# Altium project ADC_IO.PrjPcb
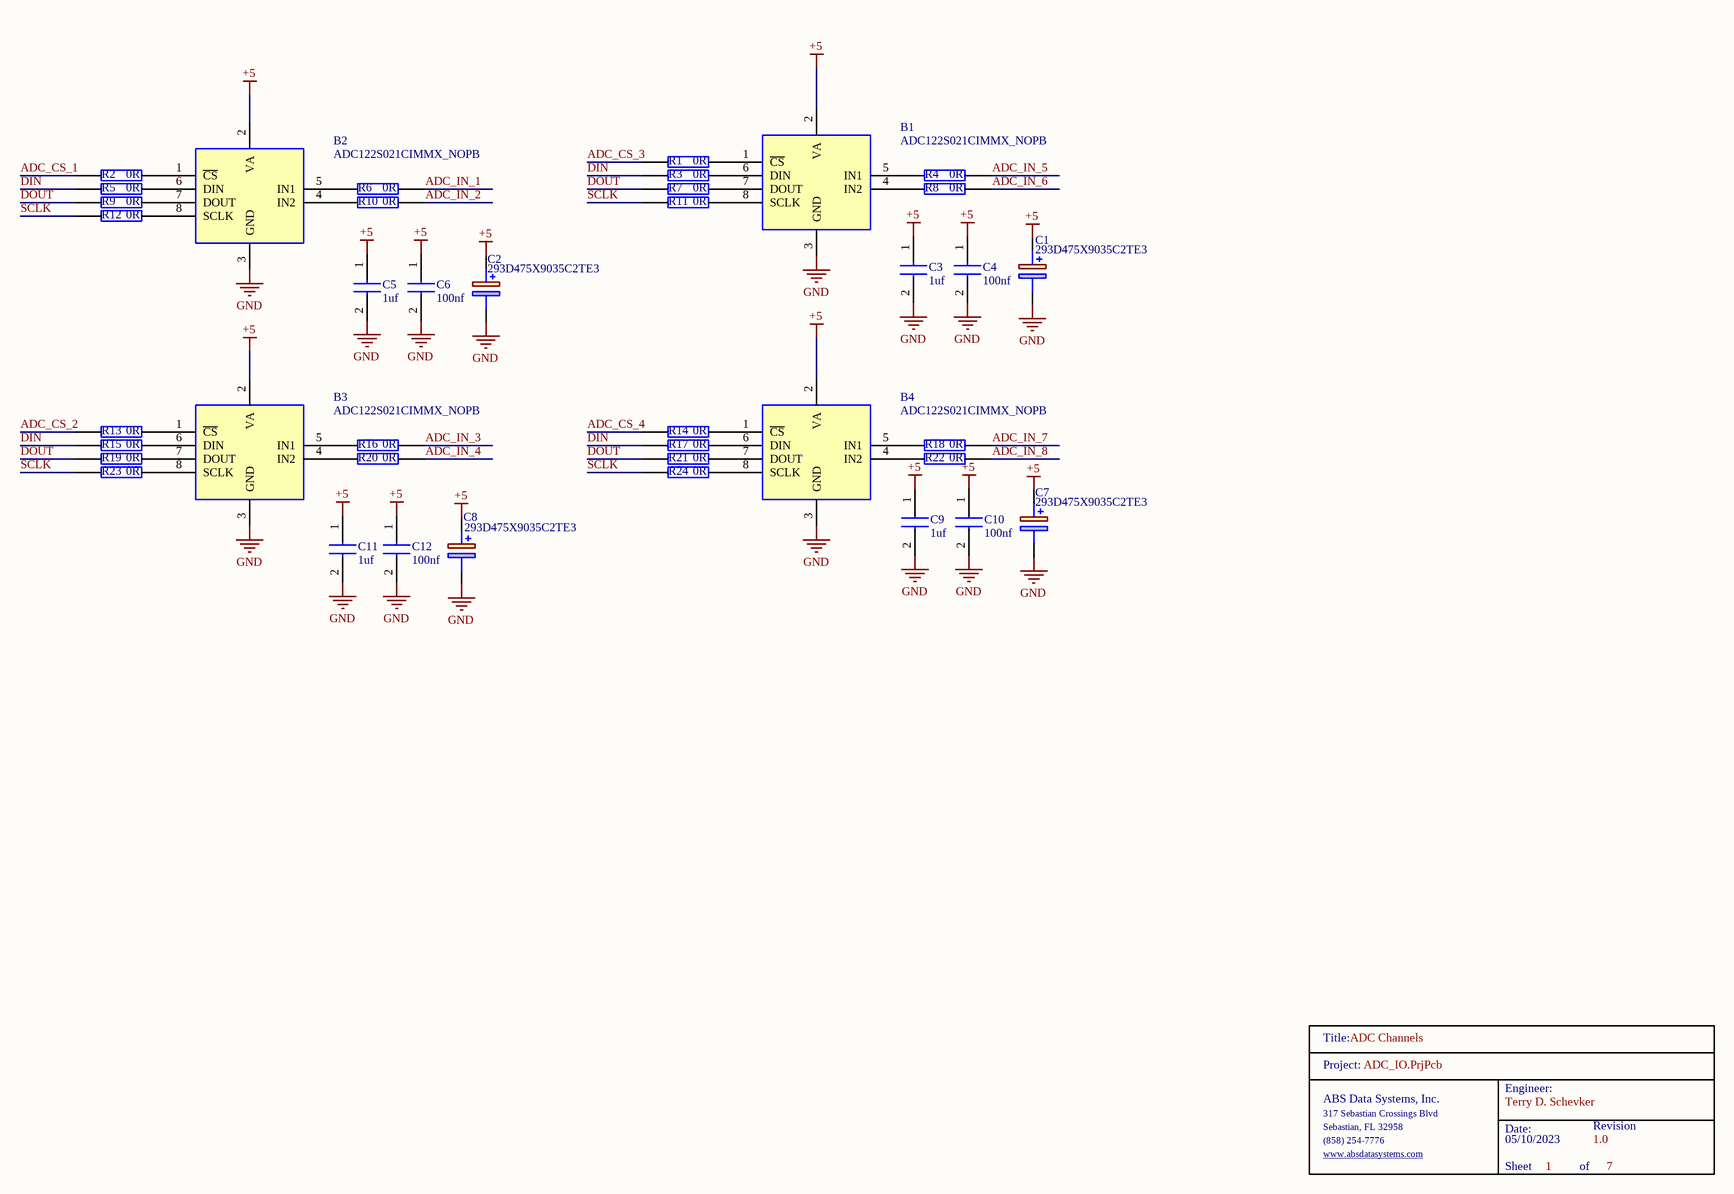
[diagram p0: ADC_Channels.SchDoc]
7 sheets, 251 parts. Net scope: global (net labels, ports and power ports of the same name join across sheets).
Board file: ADC_PCB.PcbDoc
Sheets:
  ADC_Channels.SchDoc
  ADC_LED_Monitor.SchDoc
  ADC_CPU.SchDoc
  ADC_Configuration.SchDoc
  ADC_Unity_Gain.SchDoc
  ADC_Calibration.SchDoc
  ADC_Input.SchDoc

## Sheet ADC_Channels.SchDoc: ADC Channels
size Tabloid; Date: 05/10/2023; Engineer: Terry D. Schevker; Revision: 1.0; SheetNumber: 1; SheetTotal: 7

### Parts
B1  ADC122S021CIMMX_NOPB  [SOP65P490X110-8N]
B2  ADC122S021CIMMX_NOPB  [SOP65P490X110-8N]
B3  ADC122S021CIMMX_NOPB  [SOP65P490X110-8N]
B4  ADC122S021CIMMX_NOPB  [SOP65P490X110-8N]
C1  293D475X9035C2TE3  [CAPPM6032X280N]
C2  293D475X9035C2TE3  [CAPPM6032X280N]
C3  1uf  [0603]
C4  100nf  [0603]
C5  1uf  [0603]
C6  100nf  [0603]
C7  293D475X9035C2TE3  [CAPPM6032X280N]
C8  293D475X9035C2TE3  [CAPPM6032X280N]
C9  1uf  [0603]
C10  100nf  [0603]
C11  1uf  [0603]
C12  100nf  [0603]
R1  0R  [0603]
R2  0R  [0603]
R3  0R  [0603]
R4  0R  [0603]
R5  0R  [0603]
R6  0R  [0603]
R7  0R  [0603]
R8  0R  [0603]
R9  0R  [0603]
R10  0R  [0603]
R11  0R  [0603]
R12  0R  [0603]
R13  0R  [0603]
R14  0R  [0603]
R15  0R  [0603]
R16  0R  [0603]
R17  0R  [0603]
R18  0R  [0603]
R19  0R  [0603]
R20  0R  [0603]
R21  0R  [0603]
R22  0R  [0603]
R23  0R  [0603]
R24  0R  [0603]
TitleBlock_1  TitleBlock  (value not drawn)  (graphical)

### Nets
+5: B1.2(VA) B2.2(VA) B3.2(VA) B4.2(VA) C1.1(+) C2.1(+) C3.1 C4.1 C5.1 C6.1 C7.1(+) C8.1(+) C9.1 C10.1 C11.1 C12.1
GND: B1.3(GND) B2.3(GND) B3.3(GND) B4.3(GND) C1.2(-) C2.2(-) C3.2 C4.2 C5.2 C6.2 C7.2(-) C8.2(-) C9.2 C10.2 C11.2 C12.2
ADC_CS_1: R2.1
ADC_CS_2: R13.1
ADC_CS_3: R1.1
ADC_CS_4: R14.1
ADC_IN_1: R6.2
ADC_IN_2: R10.2
ADC_IN_3: R16.2
ADC_IN_4: R20.2
ADC_IN_5: R4.2
ADC_IN_6: R8.2
ADC_IN_7: R18.2
ADC_IN_8: R22.2
DIN: R3.1 R5.1 R15.1 R17.1
DOUT: R7.1 R9.1 R19.1 R21.1
SCLK: R11.1 R12.1 R23.1 R24.1
NetB1_1: B1.1(~{CS}) R1.2
NetB1_4: B1.4(IN2) R8.1
NetB1_5: B1.5(IN1) R4.1
NetB1_6: B1.6(DIN) R3.2
NetB1_7: B1.7(DOUT) R7.2
NetB1_8: B1.8(SCLK) R11.2
NetB2_1: B2.1(~{CS}) R2.2
NetB2_4: B2.4(IN2) R10.1
NetB2_5: B2.5(IN1) R6.1
NetB2_6: B2.6(DIN) R5.2
NetB2_7: B2.7(DOUT) R9.2
NetB2_8: B2.8(SCLK) R12.2
NetB3_1: B3.1(~{CS}) R13.2
NetB3_4: B3.4(IN2) R20.1
NetB3_5: B3.5(IN1) R16.1
NetB3_6: B3.6(DIN) R15.2
NetB3_7: B3.7(DOUT) R19.2
NetB3_8: B3.8(SCLK) R23.2
NetB4_1: B4.1(~{CS}) R14.2
NetB4_4: B4.4(IN2) R22.1
NetB4_5: B4.5(IN1) R18.1
NetB4_6: B4.6(DIN) R17.2
NetB4_7: B4.7(DOUT) R21.2
NetB4_8: B4.8(SCLK) R24.2

### Notes on the sheet
- (in symbol TitleBlock) Title:; Project:; Engineer:; ABS Data Systems, Inc.; 317 Sebastian Crossings Blvd; Sebastian, FL 32958; Date:; Revision; (858) 254-7776; www.absdatasystems.com; Sheet; of

### Library data of the parts
B1-B4 = ADC122S021CIMMX_NOPB: 2 Channel, 50 ksps to 200 ksps 12-Bit A/D Converter; Manufacturer_Name: Texas Instruments; Manufacturer_Part_Number: ADC122S021CIMMX/NOPB; Geometry.Height: 1.1mm; Mouser Part Number: 926-A122S021CIMMXNPB; Mouser Price/Stock: https://www.mouser.co.uk/ProductDetail/Texas-Instruments/ADC122S021CIMMX-NOPB/?qs=7X5t%252BdzoRHB2bC7Teu8H3A%3D%3D; Datasheet Link: http://www.ti.com/lit/gpn/ADC122S021
C1 C2 C7 C8 = 293D475X9035C2TE3: Solid Tantalum Surface Mount Chip Capacitors TANTAMOUNT(TM), Molded Case, Standard Industrial Grade; Manufacturer_Name: Vishay; Geometry.Height: 2.8mm; Mouser Part Number: 74-293D475X9035C2TE3; Mouser Price/Stock: https://www.mouser.co.uk/ProductDetail/Vishay-Sprague/293D475X9035C2TE3?qs=L4BSZja3YaK5uiX7PSIEuA%3D%3D; Manufacturer_Part_Number: 293D475X9035C2TE3; Datasheet Link: http://www.vishay.com/docs/40002/293d.pdf
C3 C5 C9 C11 = CL10B105KA8NNNL: Samsung Electro-Mechanics 0603 1uf
C4 C6 C10 C12 = CL10B104JB8NNNC: Samsung Electro-Mechanics 0603 100nf
R1-R24 = RC0603JR-070RL: YAGEO 0603 0 ohm; Manufacturer_Name: KEMET; Geometry.Height: 0.55mm; Mouser Part Number: 603-RC0603JR-070RL; Mouser Price/Stock: https://www.mouser.co.uk/ProductDetail/YAGEO/RC0603JR-070RL?qs=2cAdsCoAWRGWyPcuXgGiXQ%3D%3D; Manufacturer_Part_Number: RC0603JR-070RL; Datasheet Link: https://datasheet.datasheetarchive.com/originals/distributors/Datasheets_SAMA/902f9e387b938f871d31120f5fc1d65e.pdf

## Sheet ADC_LED_Monitor.SchDoc: ADC Led Monitor
size Tabloid; Date: 05/10/2023; Engineer: Terry D. Schevker; Revision: 1.0; SheetNumber: 2; SheetTotal: 7
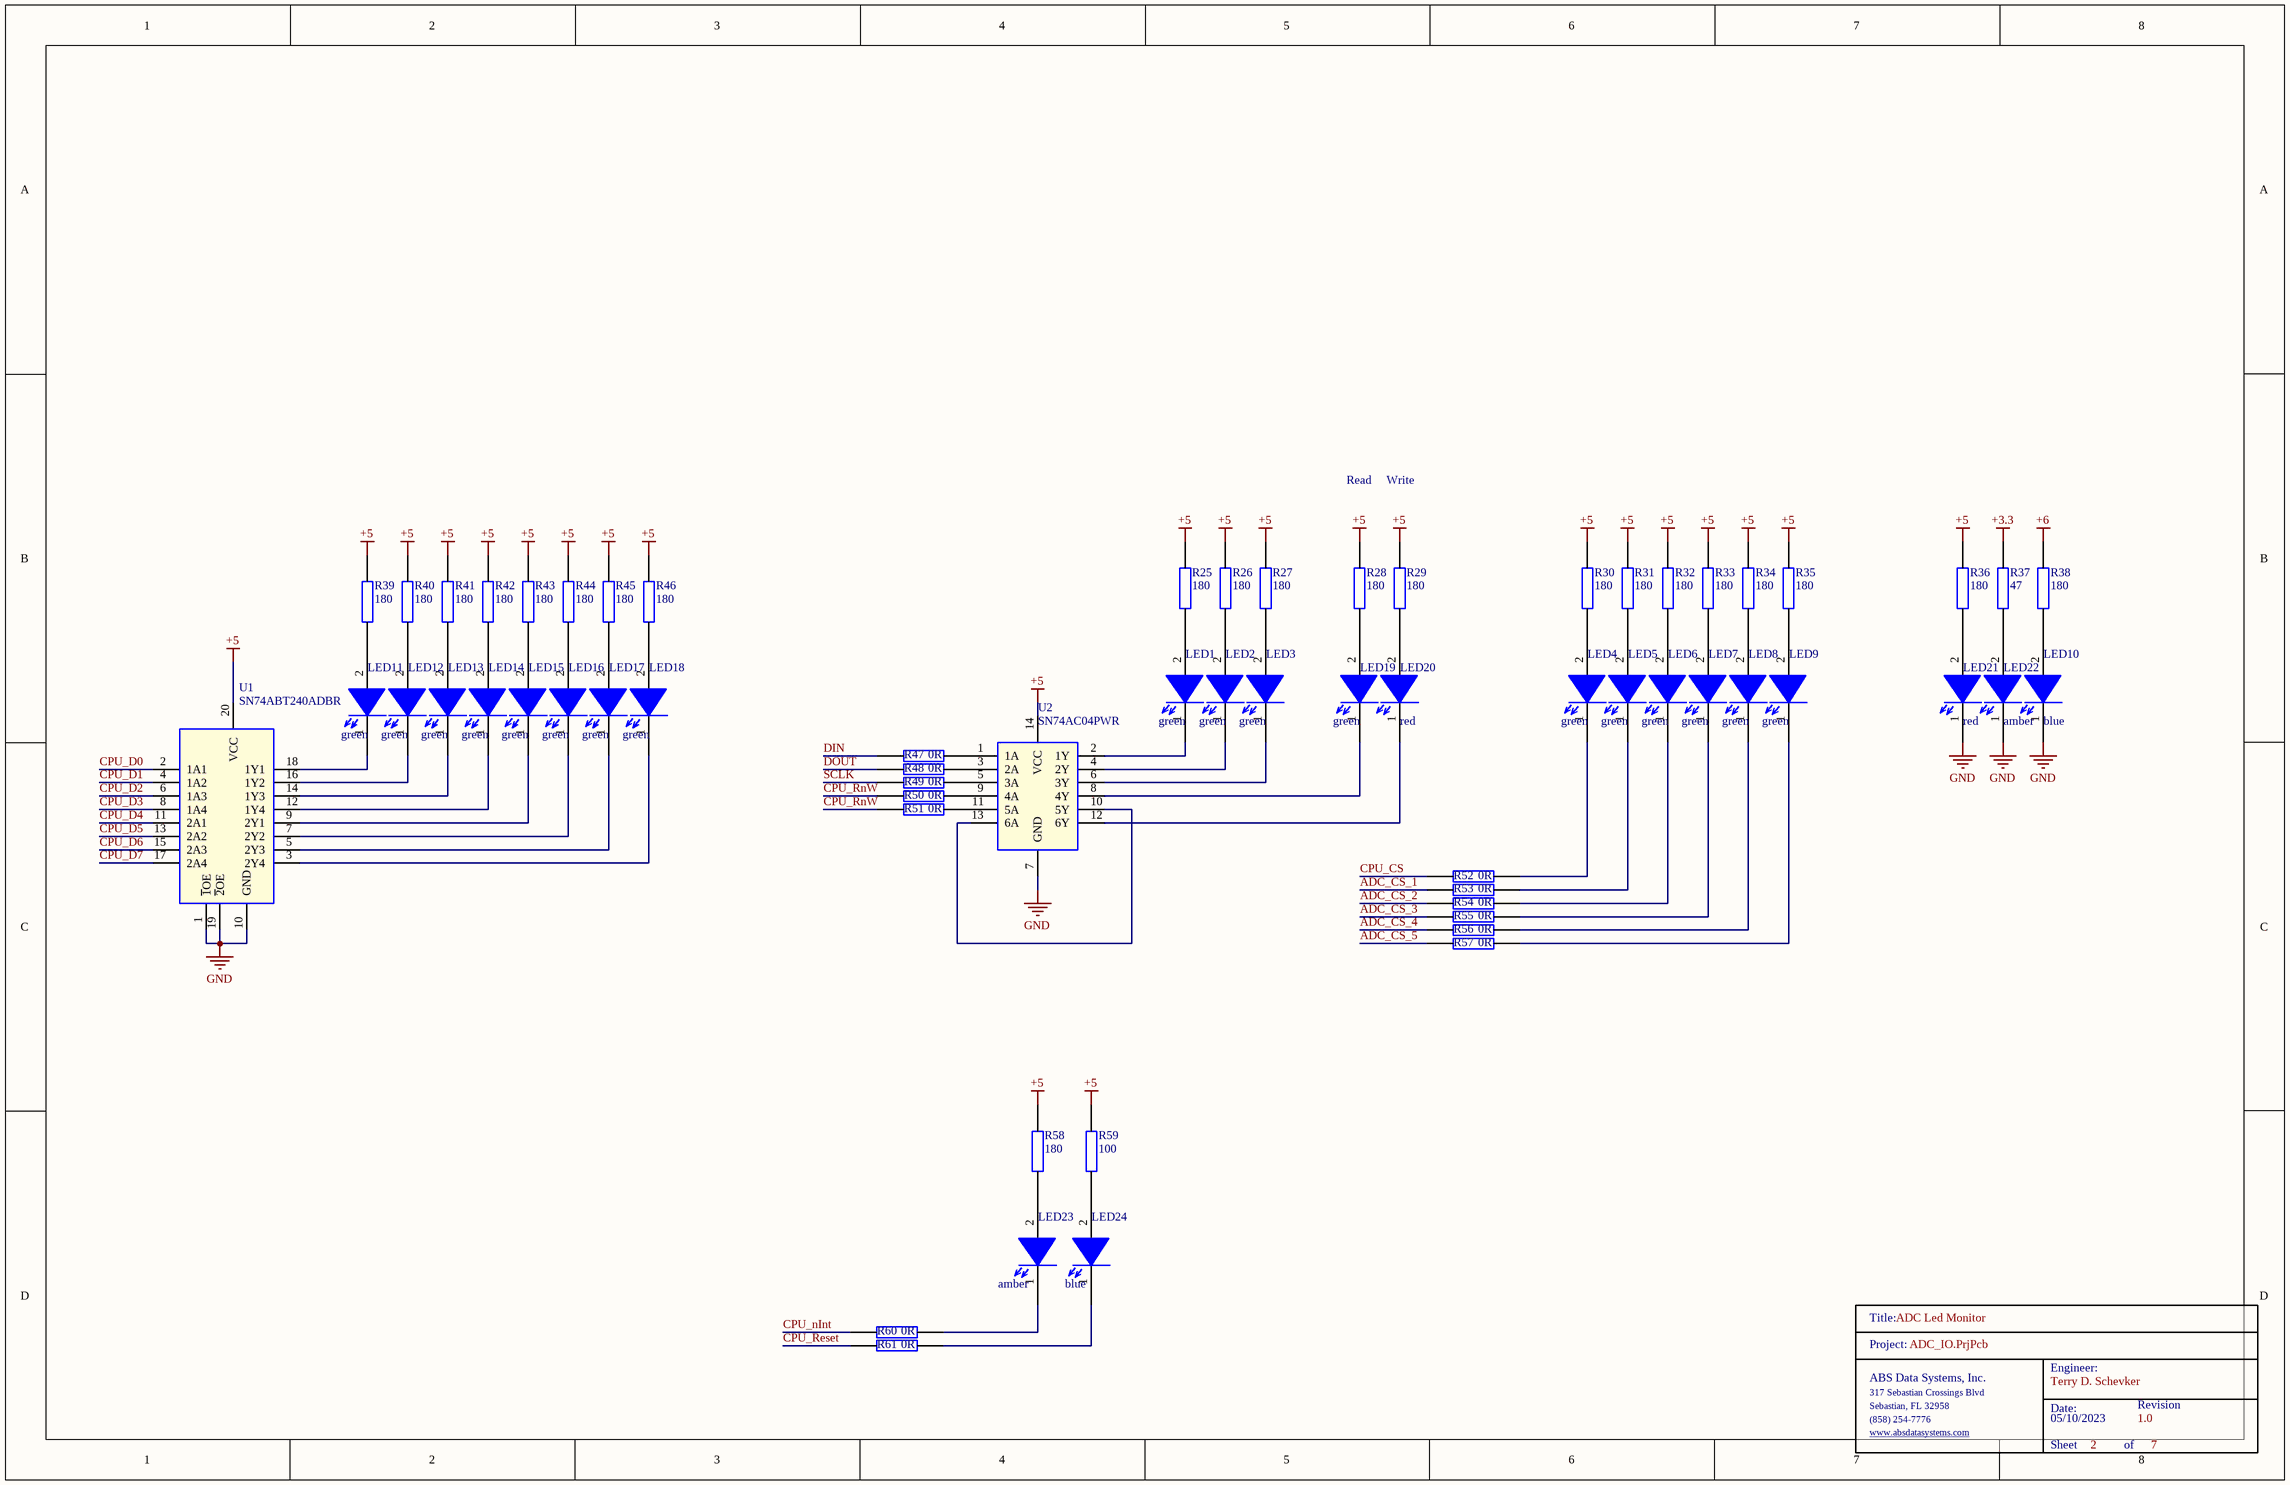
[diagram p1: ADC_LED_Monitor.SchDoc]

### Parts
LED1  green  [0603_Diode]
LED2  green  [0603_Diode]
LED3  green  [0603_Diode]
LED4  green  [0603_Diode]
LED5  green  [0603_Diode]
LED6  green  [0603_Diode]
LED7  green  [0603_Diode]
LED8  green  [0603_Diode]
LED9  green  [0603_Diode]
LED10  blue  [0603_Diode]
LED11  green  [0603_Diode]
LED12  green  [0603_Diode]
LED13  green  [0603_Diode]
LED14  green  [0603_Diode]
LED15  green  [0603_Diode]
LED16  green  [0603_Diode]
LED17  green  [0603_Diode]
LED18  green  [0603_Diode]
LED19  green  [0603_Diode]
LED20  red  [0603_Diode]
LED21  red  [0603_Diode]
LED22  amber  [0603_Diode]
LED23  amber  [0603_Diode]
LED24  blue  [0603_Diode]
R25  180  [0603]
R26  180  [0603]
R27  180  [0603]
R28  180  [0603]
R29  180  [0603]
R30  180  [0603]
R31  180  [0603]
R32  180  [0603]
R33  180  [0603]
R34  180  [0603]
R35  180  [0603]
R36  180  [0603]
R37  47  [0603]
R38  180  [0603]
R39  180  [0603]
R40  180  [0603]
R41  180  [0603]
R42  180  [0603]
R43  180  [0603]
R44  180  [0603]
R45  180  [0603]
R46  180  [0603]
R47  0R  [0603]
R48  0R  [0603]
R49  0R  [0603]
R50  0R  [0603]
R51  0R  [0603]
R52  0R  [0603]
R53  0R  [0603]
R54  0R  [0603]
R55  0R  [0603]
R56  0R  [0603]
R57  0R  [0603]
R58  180  [0603]
R59  100  [0603]
R60  0R  [0603]
R61  0R  [0603]
TitleBlock_2  TitleBlock  (value not drawn)  (graphical)
U1  SN74ABT240ADBR  [SOP65P780X200-20N]
U2  SN74AC04PWR  [SOP65P640X120-14N]

### Nets
+3.3: R37.1
+5: R25.2 R26.2 R27.2 R28.2 R29.2 R30.2 R31.2 R32.2 R33.2 R34.2 R35.2 R36.2 R39.2 R40.2 R41.2 R42.2 R43.2 R44.2 R45.2 R46.2 R58.2 R59.1 U1.20(VCC) U2.14(VCC)
+6: R38.2
GND: LED10.1(K) LED21.1(K) LED22.1(K) U1.1(~{1}OE) U1.10(GND) U1.19(~{2}OE) U2.7(GND)
ADC_CS_1: R53.1
ADC_CS_2: R54.1
ADC_CS_3: R55.1
ADC_CS_4: R56.1
ADC_CS_5: R57.1
CPU_CS: R52.1
CPU_D0: U1.2(1A1)
CPU_D1: U1.4(1A2)
CPU_D2: U1.6(1A3)
CPU_D3: U1.8(1A4)
CPU_D4: U1.11(2A1)
CPU_D5: U1.13(2A2)
CPU_D6: U1.15(2A3)
CPU_D7: U1.17(2A4)
CPU_nInt: R60.1
CPU_Reset: R61.1
CPU_RnW: R50.1 R51.1
DIN: R47.1
DOUT: R48.1
SCLK: R49.1
NetLED1_1: LED1.1(K) U2.2(1Y)
NetLED1_2: LED1.2(A) R25.1
NetLED2_1: LED2.1(K) U2.4(2Y)
NetLED2_2: LED2.2(A) R26.1
NetLED3_1: LED3.1(K) U2.6(3Y)
NetLED3_2: LED3.2(A) R27.1
NetLED4_1: LED4.1(K) R52.2
NetLED4_2: LED4.2(A) R30.1
NetLED5_1: LED5.1(K) R53.2
NetLED5_2: LED5.2(A) R31.1
NetLED6_1: LED6.1(K) R54.2
NetLED6_2: LED6.2(A) R32.1
NetLED7_1: LED7.1(K) R55.2
NetLED7_2: LED7.2(A) R33.1
NetLED8_1: LED8.1(K) R56.2
NetLED8_2: LED8.2(A) R34.1
NetLED9_1: LED9.1(K) R57.2
NetLED9_2: LED9.2(A) R35.1
NetLED10_2: LED10.2(A) R38.1
NetLED11_1: LED11.1(K) U1.18(1Y1)
NetLED11_2: LED11.2(A) R39.1
NetLED12_1: LED12.1(K) U1.16(1Y2)
NetLED12_2: LED12.2(A) R40.1
NetLED13_1: LED13.1(K) U1.14(1Y3)
NetLED13_2: LED13.2(A) R41.1
NetLED14_1: LED14.1(K) U1.12(1Y4)
NetLED14_2: LED14.2(A) R42.1
NetLED15_1: LED15.1(K) U1.9(2Y1)
NetLED15_2: LED15.2(A) R43.1
NetLED16_1: LED16.1(K) U1.7(2Y2)
NetLED16_2: LED16.2(A) R44.1
NetLED17_1: LED17.1(K) U1.5(2Y3)
NetLED17_2: LED17.2(A) R45.1
NetLED18_1: LED18.1(K) U1.3(2Y4)
NetLED18_2: LED18.2(A) R46.1
NetLED19_1: LED19.1(K) U2.8(4Y)
NetLED19_2: LED19.2(A) R28.1
NetLED20_1: LED20.1(K) U2.12(6Y)
NetLED20_2: LED20.2(A) R29.1
NetLED21_2: LED21.2(A) R36.1
NetLED22_2: LED22.2(A) R37.2
NetLED23_1: LED23.1(K) R60.2
NetLED23_2: LED23.2(A) R58.1
NetLED24_1: LED24.1(K) R61.2
NetLED24_2: LED24.2(A) R59.2
NetR47_2: R47.2 U2.1(1A)
NetR48_2: R48.2 U2.3(2A)
NetR49_2: R49.2 U2.5(3A)
NetR50_2: R50.2 U2.9(4A)
NetR51_2: R51.2 U2.11(5A)
NetU2_10: U2.10(5Y) U2.13(6A)

### Notes on the sheet
- Read
- Write
- (in symbol TitleBlock) Title:; Project:; Engineer:; ABS Data Systems, Inc.; 317 Sebastian Crossings Blvd; Sebastian, FL 32958; Date:; Revision; (858) 254-7776; www.absdatasystems.com; Sheet; of

### Library data of the parts
LED1-LED9 LED11-LED19 = 150060GS75000: Wurth Elektronik 0603 green; Manufacturer: Wurth Electronics; Wavelength: 520nm; Viewing Angle: 140°; Lens Style: Clear,Rectangular; Luminous Intensity: 430mcd; Forward Current: 30mA; Forward Voltage: 3.2V; Test Current: 20mA; Supplier 1: Digi-Key; Manufacturer Part Number: 150060GS75000; RoHS: Yes; Category: LEDs; Stock 1: 71509; Pricing 1: 1=0.14000, 50=0.13300, 100=0.11400, 500=0.09900 (USD); Mount: Surface Mount; Case/Package: 0603; Color: Green; Case Code (Metric): 1608; Case Code (Imperial): 0603; Min Operating Temperature: -40°C; Max Operating Temperature: 85°C; Package Quantity: 4000; Packaging: Tape and Reel; Dominant Wavelength: 520nm; Length: 1.6mm; Width: 0.8mm; Height: 0.7mm; REACH SVHC: Unknown; Lead Free: Lead Free; ComponentLink1URL: https://datasheet.ciiva.com/29562/150060gs75000-29562868.pdf?src-supplier=Digi-Key; ComponentLink1Description: https://datasheet.ciiva.com/29562/150060gs75000-29562868.pdf?src-supplier=Digi-Key; ComponentLink2URL: https://datasheet.ciiva.com/29279/759427-da-01-en-chipled-0603-w-kl-gruen-150060gs75000-29279201.pdf?src-supplier=Conrad; ComponentLink2Description: https://datasheet.ciiva.com/29279/759427-da-01-en-chipled-0603-w-kl-gruen-150060gs75000-29279201.pdf?src-supplier=Conrad; ComponentLink3URL: https://datasheet.ciiva.com/29562/150060gs75000-29562869.pdf?src-supplier=Digi-Key; ComponentLink3Description: https://datasheet.ciiva.com/29562/150060gs75000-29562869.pdf?src-supplier=Digi-Key; ComponentLink4URL: https://datasheet.ciiva.com/29562/150060gs75000-29562870.pdf?src-supplier=Digi-Key; ComponentLink4Description: https://datasheet.ciiva.com/29562/150060gs75000-29562870.pdf?src-supplier=Digi-Key
LED10 LED24 = 150060BS75000: Wurth Elektronik 0603 blue; Manufacturer: Wurth Electronics; Manufacturer Part Number: 150060GS75000; Color: Green; Wavelength: 520nm; Viewing Angle: 140°; Lens Style: Clear,Rectangular; Luminous Intensity: 430mcd; Forward Current: 30mA; Forward Voltage: 3.2V; Test Current: 20mA; Supplier 1: Digi-Key; RoHS: Yes; Category: LEDs; Stock 1: 71509; Pricing 1: 1=0.14000, 50=0.13300, 100=0.11400, 500=0.09900 (USD); Mount: Surface Mount; Case/Package: 0603; Case Code (Metric): 1608; Case Code (Imperial): 0603; Min Operating Temperature: -40°C; Max Operating Temperature: 85°C; Package Quantity: 4000; Packaging: Tape and Reel; Dominant Wavelength: 520nm; Length: 1.6mm; Width: 0.8mm; Height: 0.7mm; REACH SVHC: Unknown; Lead Free: Lead Free; ComponentLink1URL: https://datasheet.ciiva.com/29562/150060gs75000-29562868.pdf?src-supplier=Digi-Key; ComponentLink1Description: https://datasheet.ciiva.com/29562/150060gs75000-29562868.pdf?src-supplier=Digi-Key; ComponentLink2URL: https://datasheet.ciiva.com/29279/759427-da-01-en-chipled-0603-w-kl-gruen-150060gs75000-29279201.pdf?src-supplier=Conrad; ComponentLink2Description: https://datasheet.ciiva.com/29279/759427-da-01-en-chipled-0603-w-kl-gruen-150060gs75000-29279201.pdf?src-supplier=Conrad; ComponentLink3URL: https://datasheet.ciiva.com/29562/150060gs75000-29562869.pdf?src-supplier=Digi-Key; ComponentLink3Description: https://datasheet.ciiva.com/29562/150060gs75000-29562869.pdf?src-supplier=Digi-Key; ComponentLink4URL: https://datasheet.ciiva.com/29562/150060gs75000-29562870.pdf?src-supplier=Digi-Key; ComponentLink4Description: https://datasheet.ciiva.com/29562/150060gs75000-29562870.pdf?src-supplier=Digi-Key
LED20 LED21 = 150060RS75000: Wurth Elektronik 0603 red; Manufacturer: Wurth Electronics; Manufacturer Part Number: 150060GS75000; Color: Green; Wavelength: 520nm; Viewing Angle: 140°; Lens Style: Clear,Rectangular; Luminous Intensity: 430mcd; Forward Current: 30mA; Forward Voltage: 3.2V; Test Current: 20mA; Supplier 1: Digi-Key; RoHS: Yes; Category: LEDs; Stock 1: 71509; Pricing 1: 1=0.14000, 50=0.13300, 100=0.11400, 500=0.09900 (USD); Mount: Surface Mount; Case/Package: 0603; Case Code (Metric): 1608; Case Code (Imperial): 0603; Min Operating Temperature: -40°C; Max Operating Temperature: 85°C; Package Quantity: 4000; Packaging: Tape and Reel; Dominant Wavelength: 520nm; Length: 1.6mm; Width: 0.8mm; Height: 0.7mm; REACH SVHC: Unknown; Lead Free: Lead Free; ComponentLink1URL: https://datasheet.ciiva.com/29562/150060gs75000-29562868.pdf?src-supplier=Digi-Key; ComponentLink1Description: https://datasheet.ciiva.com/29562/150060gs75000-29562868.pdf?src-supplier=Digi-Key; ComponentLink2URL: https://datasheet.ciiva.com/29279/759427-da-01-en-chipled-0603-w-kl-gruen-150060gs75000-29279201.pdf?src-supplier=Conrad; ComponentLink2Description: https://datasheet.ciiva.com/29279/759427-da-01-en-chipled-0603-w-kl-gruen-150060gs75000-29279201.pdf?src-supplier=Conrad; ComponentLink3URL: https://datasheet.ciiva.com/29562/150060gs75000-29562869.pdf?src-supplier=Digi-Key; ComponentLink3Description: https://datasheet.ciiva.com/29562/150060gs75000-29562869.pdf?src-supplier=Digi-Key; ComponentLink4URL: https://datasheet.ciiva.com/29562/150060gs75000-29562870.pdf?src-supplier=Digi-Key; ComponentLink4Description: https://datasheet.ciiva.com/29562/150060gs75000-29562870.pdf?src-supplier=Digi-Key
LED22 LED23 = 150060AS75000: Wurth Elektronik 0603 amber; Manufacturer: Wurth Electronics; Manufacturer Part Number: 150060GS75000; Color: Green; Wavelength: 520nm; Viewing Angle: 140°; Lens Style: Clear,Rectangular; Luminous Intensity: 430mcd; Forward Current: 30mA; Forward Voltage: 3.2V; Test Current: 20mA; Supplier 1: Digi-Key; RoHS: Yes; Category: LEDs; Stock 1: 71509; Pricing 1: 1=0.14000, 50=0.13300, 100=0.11400, 500=0.09900 (USD); Mount: Surface Mount; Case/Package: 0603; Case Code (Metric): 1608; Case Code (Imperial): 0603; Min Operating Temperature: -40°C; Max Operating Temperature: 85°C; Package Quantity: 4000; Packaging: Tape and Reel; Dominant Wavelength: 520nm; Length: 1.6mm; Width: 0.8mm; Height: 0.7mm; REACH SVHC: Unknown; Lead Free: Lead Free; ComponentLink1URL: https://datasheet.ciiva.com/29562/150060gs75000-29562868.pdf?src-supplier=Digi-Key; ComponentLink1Description: https://datasheet.ciiva.com/29562/150060gs75000-29562868.pdf?src-supplier=Digi-Key; ComponentLink2URL: https://datasheet.ciiva.com/29279/759427-da-01-en-chipled-0603-w-kl-gruen-150060gs75000-29279201.pdf?src-supplier=Conrad; ComponentLink2Description: https://datasheet.ciiva.com/29279/759427-da-01-en-chipled-0603-w-kl-gruen-150060gs75000-29279201.pdf?src-supplier=Conrad; ComponentLink3URL: https://datasheet.ciiva.com/29562/150060gs75000-29562869.pdf?src-supplier=Digi-Key; ComponentLink3Description: https://datasheet.ciiva.com/29562/150060gs75000-29562869.pdf?src-supplier=Digi-Key; ComponentLink4URL: https://datasheet.ciiva.com/29562/150060gs75000-29562870.pdf?src-supplier=Digi-Key; ComponentLink4Description: https://datasheet.ciiva.com/29562/150060gs75000-29562870.pdf?src-supplier=Digi-Key
R25-R36 R38-R46 R58 = RC0603FR-13180RL: YAGEO 0603 180 ohm; Manufacturer_Name: KEMET; Manufacturer_Part_Number: RC0603JR-070RL; Geometry.Height: 0.55mm; Mouser Part Number: 603-RC0603JR-070RL; Mouser Price/Stock: https://www.mouser.co.uk/ProductDetail/YAGEO/RC0603JR-070RL?qs=2cAdsCoAWRGWyPcuXgGiXQ%3D%3D; Datasheet Link: https://datasheet.datasheetarchive.com/originals/distributors/Datasheets_SAMA/902f9e387b938f871d31120f5fc1d65e.pdf
R37 = RC0603FR-0747KL: YAGEO 0603 47; Manufacturer_Name: KEMET; Manufacturer_Part_Number: RC0603JR-070RL; Geometry.Height: 0.55mm; Mouser Part Number: 603-RC0603JR-070RL; Mouser Price/Stock: https://www.mouser.co.uk/ProductDetail/YAGEO/RC0603JR-070RL?qs=2cAdsCoAWRGWyPcuXgGiXQ%3D%3D; Datasheet Link: https://datasheet.datasheetarchive.com/originals/distributors/Datasheets_SAMA/902f9e387b938f871d31120f5fc1d65e.pdf
R47-R57 R60 R61 = RC0603JR-070RL: as R1 on sheet ADC_Channels; Mouser Part Number: 603-RC0603JR-070RL; Mouser Price/Stock: https://www.mouser.co.uk/ProductDetail/YAGEO/RC0603JR-070RL?qs=2cAdsCoAWRGWyPcuXgGiXQ%3D%3D; Manufacturer_Part_Number: RC0603JR-070RL; Datasheet Link: https://datasheet.datasheetarchive.com/originals/distributors/Datasheets_SAMA/902f9e387b938f871d31120f5fc1d65e.pdf
R59 = RC0603FR-10100RL: YAGEO 0603 100 ohm; Manufacturer_Name: KEMET; Manufacturer_Part_Number: RC0603JR-070RL; Geometry.Height: 0.55mm; Mouser Part Number: 603-RC0603JR-070RL; Mouser Price/Stock: https://www.mouser.co.uk/ProductDetail/YAGEO/RC0603JR-070RL?qs=2cAdsCoAWRGWyPcuXgGiXQ%3D%3D; Datasheet Link: https://datasheet.datasheetarchive.com/originals/distributors/Datasheets_SAMA/902f9e387b938f871d31120f5fc1d65e.pdf
U1 = SN74ABT240ADBR: Octal Buffers/Drivers With 3-State Outputs; Manufacturer_Name: Texas Instruments; Geometry.Height: 2mm; Mouser Part Number: 595-SN74ABT240ADBR; Mouser Price/Stock: https://www.mouser.co.uk/ProductDetail/Texas-Instruments/SN74ABT240ADBR?qs=JHHQeKcAU3Dt82k%252BVyiYdw%3D%3D; Manufacturer_Part_Number: SN74ABT240ADBR; Datasheet Link: http://www.ti.com/lit/gpn/sn74abt240a
U2 = SN74AC04PWR: Hex Inverters; Manufacturer_Name: Texas Instruments; Geometry.Height: 1.2mm; Mouser Part Number: 595-SN74AC04PWR; Mouser Price/Stock: https://www.mouser.co.uk/ProductDetail/Texas-Instruments/SN74AC04PWR?qs=RZS%252BpEsUn7pRvPNqsga4SA%3D%3D; Manufacturer_Part_Number: SN74AC04PWR; Datasheet Link: http://www.ti.com/lit/gpn/sn74ac04

## Sheet ADC_CPU.SchDoc: ADC CPU
size Tabloid; Date: 06/01/2023; Engineer: Terry D. Schevker; Revision: 1.0; SheetNumber: 3; SheetTotal: 7
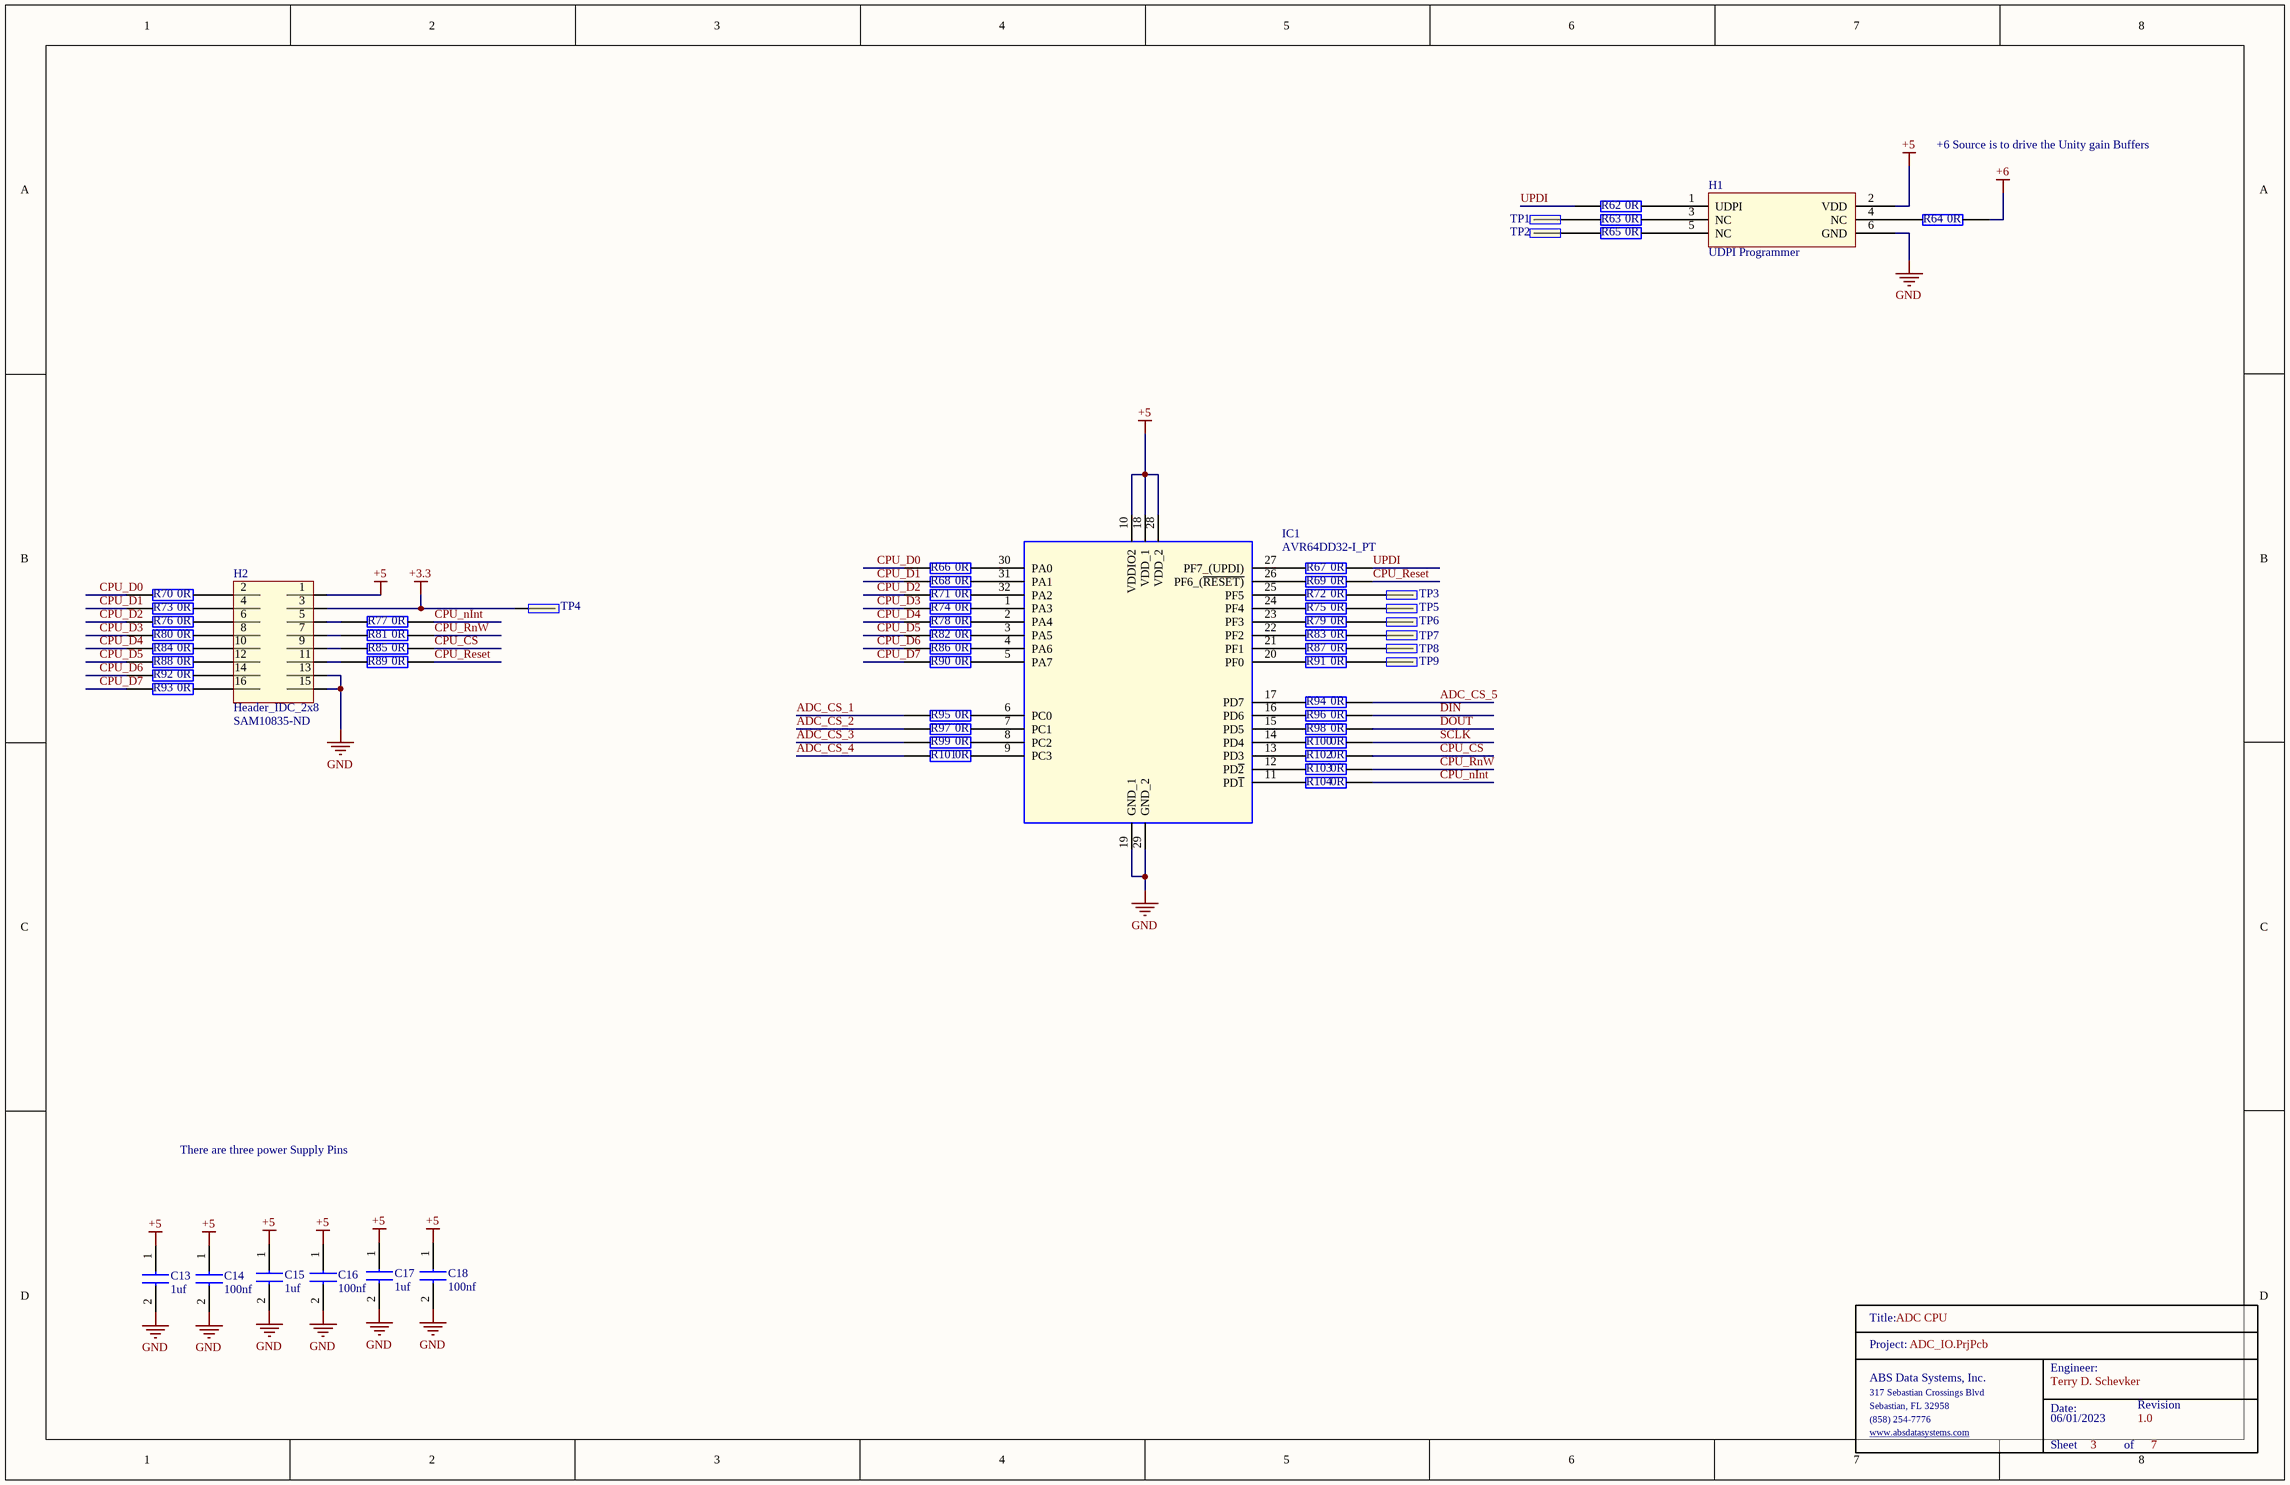
[diagram p2: ADC_CPU.SchDoc]

### Parts
C13  1uf  [0603]
C14  100nf  [0603]
C15  1uf  [0603]
C16  100nf  [0603]
C17  1uf  [0603]
C18  100nf  [0603]
H1  UDPI Programmer  [HDR2X3]
H2  Header_IDC_2x8  Supplier Part Number 1: SAM10835-ND  [HEADER16]
IC1  AVR64DD32-I_PT  [QFP80P900X900X120-32N]
R62  0R  [0603]
R63  0R  [0603]
R64  0R  [0603]
R65  0R  [0603]
R66  0R  [0603]
R67  0R  [0603]
R68  0R  [0603]
R69  0R  [0603]
R70  0R  [0603]
R71  0R  [0603]
R72  0R  [0603]
R73  0R  [0603]
R74  0R  [0603]
R75  0R  [0603]
R76  0R  [0603]
R77  0R  [0603]
R78  0R  [0603]
R79  0R  [0603]
R80  0R  [0603]
R81  0R  [0603]
R82  0R  [0603]
R83  0R  [0603]
R84  0R  [0603]
R85  0R  [0603]
R86  0R  [0603]
R87  0R  [0603]
R88  0R  [0603]
R89  0R  [0603]
R90  0R  [0603]
R91  0R  [0603]
R92  0R  [0603]
R93  0R  [0603]
R94  0R  [0603]
R95  0R  [0603]
R96  0R  [0603]
R97  0R  [0603]
R98  0R  [0603]
R99  0R  [0603]
R100  0R  [0603]
R101  0R  [0603]
R102  0R  [0603]
R103  0R  [0603]
R104  0R  [0603]
TitleBlock_3  TitleBlock  (value not drawn)  (graphical)
TP1  TP  [TP]  (value not drawn)
TP2  TP  [TP]  (value not drawn)
TP3  TP  [TP]  (value not drawn)
TP4  TP  [TP]  (value not drawn)
TP5  TP  [TP]  (value not drawn)
TP6  TP  [TP]  (value not drawn)
TP7  TP  [TP]  (value not drawn)
TP8  TP  [TP]  (value not drawn)
TP9  TP  [TP]  (value not drawn)

### Nets
+3.3: H2.3 TP4.1
+5: C13.1 C14.1 C15.1 C16.1 C17.1 C18.1 H1.2(VDD) H2.1 IC1.10(VDDIO2) IC1.18(VDD_1) IC1.28(VDD_2)
+6: R64.2
GND: C13.2 C14.2 C15.2 C16.2 C17.2 C18.2 H1.6(GND) H2.13 H2.15 IC1.19(GND_1) IC1.29(GND_2)
ADC_CS_1: R95.1
ADC_CS_2: R97.1
ADC_CS_3: R99.1
ADC_CS_4: R101.1
ADC_CS_5: R94.2
CPU_CS: R85.2 R102.2
CPU_D0: R66.1 R70.1
CPU_D1: R68.1 R73.1
CPU_D2: R71.1 R76.1
CPU_D3: R74.1 R80.1
CPU_D4: R78.1 R84.1
CPU_D5: R82.1 R88.1
CPU_D6: R86.1 R92.1
CPU_D7: R90.1 R93.1
CPU_nInt: R77.2 R104.2
CPU_Reset: R69.2 R89.2
CPU_RnW: R81.2 R103.2
DIN: R96.2
DOUT: R98.2
SCLK: R100.2
UPDI: R62.1 R67.2
NetH1_1: H1.1(UDPI) R62.2
NetH1_3: H1.3(NC) R63.2
NetH1_4: H1.4(NC) R64.1
NetH1_5: H1.5(NC) R65.2
NetH2_2: H2.2 R70.2
NetH2_4: H2.4 R73.2
NetH2_5: H2.5 R77.1
NetH2_6: H2.6 R76.2
NetH2_7: H2.7 R81.1
NetH2_8: H2.8 R80.2
NetH2_9: H2.9 R85.1
NetH2_10: H2.10 R84.2
NetH2_11: H2.11 R89.1
NetH2_12: H2.12 R88.2
NetH2_14: H2.14 R92.2
NetH2_16: H2.16 R93.2
NetIC1_1: IC1.1(PA3) R74.2
NetIC1_2: IC1.2(PA4) R78.2
NetIC1_3: IC1.3(PA5) R82.2
NetIC1_4: IC1.4(PA6) R86.2
NetIC1_5: IC1.5(PA7) R90.2
NetIC1_6: IC1.6(PC0) R95.2
NetIC1_7: IC1.7(PC1) R97.2
NetIC1_8: IC1.8(PC2) R99.2
NetIC1_9: IC1.9(PC3) R101.2
NetIC1_11: IC1.11(PD~{1}) R104.1
NetIC1_12: IC1.12(PD~{2}) R103.1
NetIC1_13: IC1.13(PD3) R102.1
NetIC1_14: IC1.14(PD4) R100.1
NetIC1_15: IC1.15(PD5) R98.1
NetIC1_16: IC1.16(PD6) R96.1
NetIC1_17: IC1.17(PD7) R94.1
NetIC1_20: IC1.20(PF0) R91.1
NetIC1_21: IC1.21(PF1) R87.1
NetIC1_22: IC1.22(PF2) R83.1
NetIC1_23: IC1.23(PF3) R79.1
NetIC1_24: IC1.24(PF4) R75.1
NetIC1_25: IC1.25(PF5) R72.1
NetIC1_26: IC1.26(PF6_(~{RESET)}) R69.1
NetIC1_27: IC1.27(PF7_(UPDI)) R67.1
NetIC1_30: IC1.30(PA0) R66.2
NetIC1_31: IC1.31(PA1) R68.2
NetIC1_32: IC1.32(PA2) R71.2
NetR63_1: R63.1 TP1.1
NetR65_1: R65.1 TP2.1
NetR72_2: R72.2 TP3.1
NetR75_2: R75.2 TP5.1
NetR79_2: R79.2 TP6.1
NetR83_2: R83.2 TP7.1
NetR87_2: R87.2 TP8.1
NetR91_2: R91.2 TP9.1

### Notes on the sheet
- +6 Source is to drive the Unity gain Buffers
- There are three power Supply Pins
- (in symbol TitleBlock) Title:; Project:; Engineer:; ABS Data Systems, Inc.; 317 Sebastian Crossings Blvd; Sebastian, FL 32958; Date:; Revision; (858) 254-7776; www.absdatasystems.com; Sheet; of

### Library data of the parts
C13 C15 C17 = CL10B105KA8NNNL: Samsung Electro-Mechanics 0603 1uf
C14 C16 C18 = CL10B104JB8NNNC: Samsung Electro-Mechanics 0603 100nf
H1 = UDPI Programmer: 6 Pin 2X3 Through Hole Header
H2 = Header_IDC_2x8: 16 Pin 2x8 Through Hold IDC Connector; Manufacturer: Samtec; Manufacturer Part Number: TST-108-01-G-D; Number of Contacts: 16; Gender: Male; Connector Type: Male Pin; Pitch: 2.54mm; Row Spacing: 0.1inch; Supplier 1: Digi-Key; RoHS: Yes; Category: Headers and Wire Housings; Stock 1: 227; Pricing 1: 1=2.85000, 10=2.73600, 100=2.28000, 500=1.93800, 1000=1.65300, 5000=1.48200 (USD); Mount: Through Hole; Contact Plating: Gold; Contact Material: Bronze; Housing Material: Polyester; Housing Color: Black; Color: Black; Min Operating Temperature: -55°C; Max Operating Temperature: 125°C; Number of Rows: 2; Termination: Solder; Packaging: Rail/Tube; Orientation: Straight; Number of Positions: 16; Length: 27.94mm; Depth: 9.27mm; Contact Mating Length: 0.25inch; REACH SVHC: No SVHC; ComponentLink1URL: https://datasheet.ciiva.com/739/tst-mkt-739845.pdf?src-supplier=Digi-Key; ComponentLink1Description: https://datasheet.ciiva.com/739/tst-mkt-739845.pdf?src-supplier=Digi-Key; ComponentLink2URL: https://datasheet.ciiva.com/10018/htst-10018510.pdf?src-supplier=Avnet; ComponentLink2Description: https://datasheet.ciiva.com/10018/htst-10018510.pdf?src-supplier=Avnet
IC1 = AVR64DD32-I_PT: Integrated Circuit; Manufacturer_Name: Microchip; Manufacturer_Part_Number: AVR64DD32-I/PT | MULTI-VOLTAGE I/O; Datasheet Link: https://www.microchip.com/en-us/product/AVR64DD32; Height: 1.2mm
R62-R104 = RC0603JR-070RL: as R1 on sheet ADC_Channels; Mouser Part Number: 603-RC0603JR-070RL; Mouser Price/Stock: https://www.mouser.co.uk/ProductDetail/YAGEO/RC0603JR-070RL?qs=2cAdsCoAWRGWyPcuXgGiXQ%3D%3D; Manufacturer_Part_Number: RC0603JR-070RL; Datasheet Link: https://datasheet.datasheetarchive.com/originals/distributors/Datasheets_SAMA/902f9e387b938f871d31120f5fc1d65e.pdf
TP1-TP9 = TP: Manufacturer: Samtec; Manufacturer Part Number: TST-105-01-G-D; Number of Contacts: 16; Gender: Male; Connector Type: Male Pin; Pitch: 2.54mm; Row Spacing: 0.1inch; Supplier 1: Digi-Key; RoHS: Yes; Category: Headers and Wire Housings; Stock 1: 227; Pricing 1: 1=2.85000, 10=2.73600, 100=2.28000, 500=1.93800, 1000=1.65300, 5000=1.48200 (USD); Mount: Through Hole; Contact Plating: Gold; Contact Material: Bronze; Housing Material: Polyester; Housing Color: Black; Color: Black; Min Operating Temperature: -55°C; Max Operating Temperature: 125°C; Number of Rows: 2; Termination: Solder; Packaging: Rail/Tube; Orientation: Straight; Number of Positions: 16; Length: 27.94mm; Depth: 9.27mm; Contact Mating Length: 0.25inch; REACH SVHC: No SVHC; ComponentLink1URL: https://datasheet.ciiva.com/739/tst-mkt-739845.pdf?src-supplier=Digi-Key; ComponentLink1Description: https://datasheet.ciiva.com/739/tst-mkt-739845.pdf?src-supplier=Digi-Key; ComponentLink2URL: https://datasheet.ciiva.com/10018/htst-10018510.pdf?src-supplier=Avnet; ComponentLink2Description: https://datasheet.ciiva.com/10018/htst-10018510.pdf?src-supplier=Avnet

## Sheet ADC_Configuration.SchDoc: ADC Configuration
size Tabloid; Date: 06/01/2023; Engineer: Terry D. Schevker; Revision: 1.0; SheetNumber: 4; SheetTotal: 7
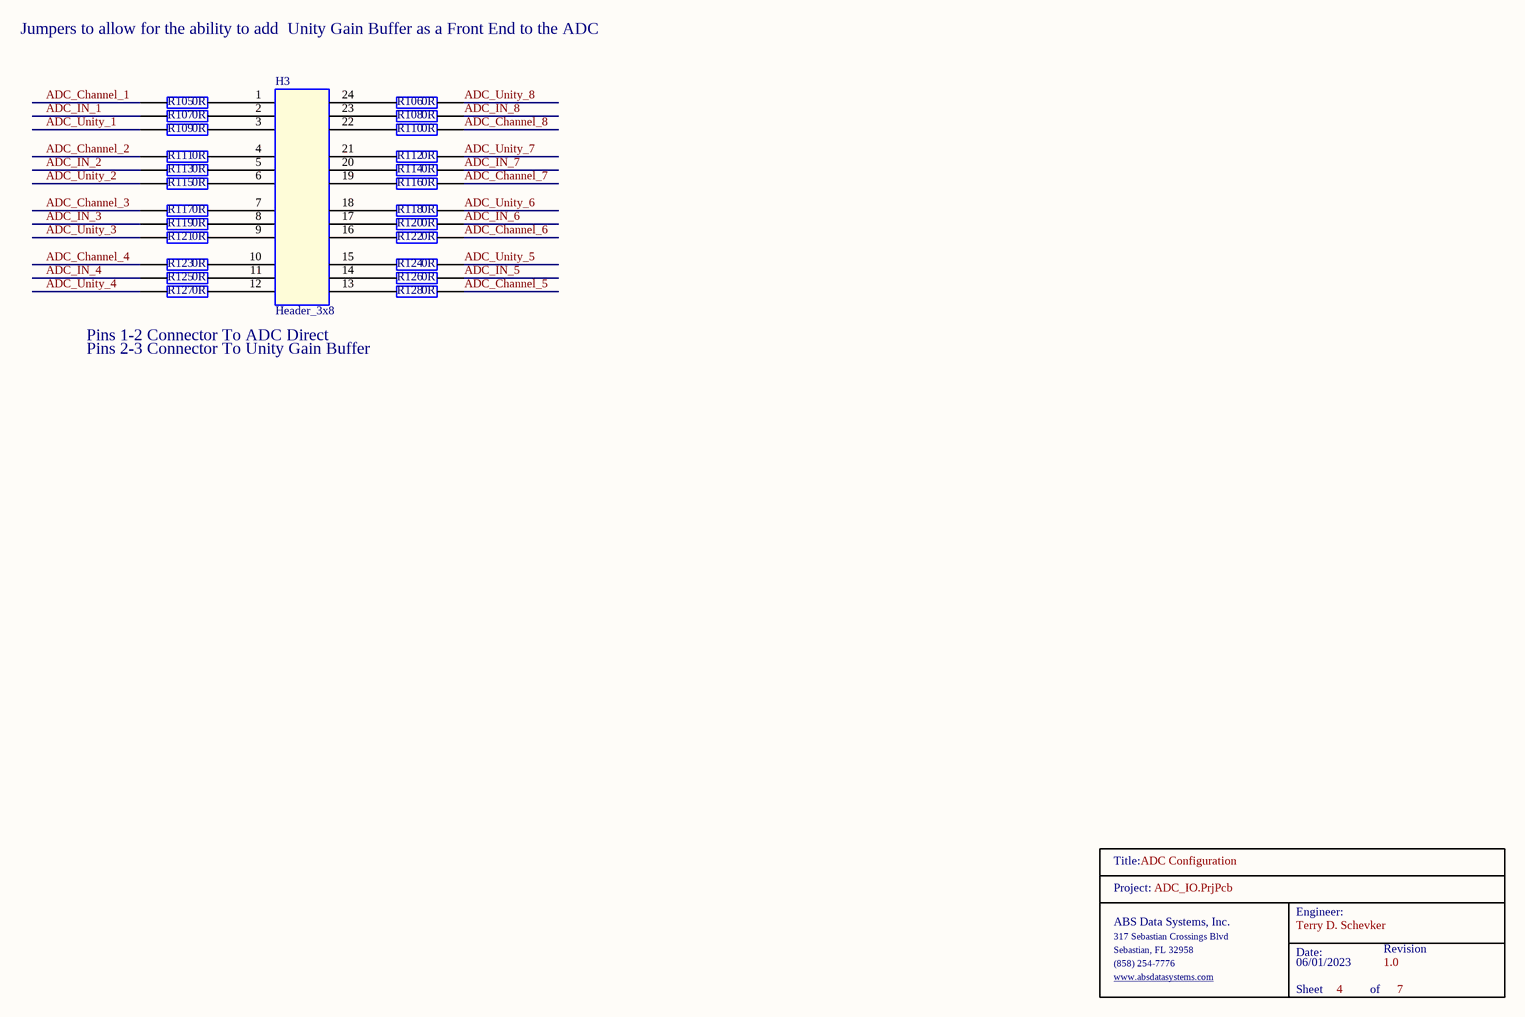
[diagram p3: ADC_Configuration.SchDoc]

### Parts
H3  Header_3x8  [HDR3X8]
R105  0R  [0603]
R106  0R  [0603]
R107  0R  [0603]
R108  0R  [0603]
R109  0R  [0603]
R110  0R  [0603]
R111  0R  [0603]
R112  0R  [0603]
R113  0R  [0603]
R114  0R  [0603]
R115  0R  [0603]
R116  0R  [0603]
R117  0R  [0603]
R118  0R  [0603]
R119  0R  [0603]
R120  0R  [0603]
R121  0R  [0603]
R122  0R  [0603]
R123  0R  [0603]
R124  0R  [0603]
R125  0R  [0603]
R126  0R  [0603]
R127  0R  [0603]
R128  0R  [0603]
TitleBlock_4  TitleBlock  (value not drawn)  (graphical)

### Nets
ADC_Channel_1: R105.1
ADC_Channel_2: R111.1
ADC_Channel_3: R117.1
ADC_Channel_4: R123.1
ADC_Channel_5: R128.2
ADC_Channel_6: R122.2
ADC_Channel_7: R116.2
ADC_Channel_8: R110.2
ADC_IN_1: R107.1
ADC_IN_2: R113.1
ADC_IN_3: R119.1
ADC_IN_4: R125.1
ADC_IN_5: R126.2
ADC_IN_6: R120.2
ADC_IN_7: R114.2
ADC_IN_8: R108.2
ADC_Unity_1: R109.1
ADC_Unity_2: R115.1
ADC_Unity_3: R121.1
ADC_Unity_4: R127.1
ADC_Unity_5: R124.2
ADC_Unity_6: R118.2
ADC_Unity_7: R112.2
ADC_Unity_8: R106.2
NetH3_1: H3.1 R105.2
NetH3_2: H3.2 R107.2
NetH3_3: H3.3 R109.2
NetH3_4: H3.4 R111.2
NetH3_5: H3.5 R113.2
NetH3_6: H3.6 R115.2
NetH3_7: H3.7 R117.2
NetH3_8: H3.8 R119.2
NetH3_9: H3.9 R121.2
NetH3_10: H3.10 R123.2
NetH3_11: H3.11 R125.2
NetH3_12: H3.12 R127.2
NetH3_13: H3.13 R128.1
NetH3_14: H3.14 R126.1
NetH3_15: H3.15 R124.1
NetH3_16: H3.16 R122.1
NetH3_17: H3.17 R120.1
NetH3_18: H3.18 R118.1
NetH3_19: H3.19 R116.1
NetH3_20: H3.20 R114.1
NetH3_21: H3.21 R112.1
NetH3_22: H3.22 R110.1
NetH3_23: H3.23 R108.1
NetH3_24: H3.24 R106.1

### Notes on the sheet
- Jumpers to allow for the ability to add  Unity Gain Buffer as a Front End to the ADC
- Pins 1-2 Connector To ADC Direct
- Pins 2-3 Connector To Unity Gain Buffer
- (in symbol TitleBlock) Title:; Project:; Engineer:; ABS Data Systems, Inc.; 317 Sebastian Crossings Blvd; Sebastian, FL 32958; Date:; Revision; (858) 254-7776; www.absdatasystems.com; Sheet; of

### Library data of the parts
H3 = Header_3x8: 16 Pin 3x8 Through Hold Jumprts; Manufacturer: Samtec; Manufacturer Part Number: TST-108-01-G-D; Number of Contacts: 16; Gender: Male; Connector Type: Male Pin; Pitch: 2.54mm; Row Spacing: 0.1inch; Supplier 1: Digi-Key; RoHS: Yes; Category: Headers and Wire Housings; Stock 1: 227; Pricing 1: 1=2.85000, 10=2.73600, 100=2.28000, 500=1.93800, 1000=1.65300, 5000=1.48200 (USD); Mount: Through Hole; Contact Plating: Gold; Contact Material: Bronze; Housing Material: Polyester; Housing Color: Black; Color: Black; Min Operating Temperature: -55°C; Max Operating Temperature: 125°C; Number of Rows: 2; Termination: Solder; Packaging: Rail/Tube; Orientation: Straight; Number of Positions: 16; Length: 27.94mm; Depth: 9.27mm; Contact Mating Length: 0.25inch; REACH SVHC: No SVHC; ComponentLink1URL: https://datasheet.ciiva.com/739/tst-mkt-739845.pdf?src-supplier=Digi-Key; ComponentLink1Description: https://datasheet.ciiva.com/739/tst-mkt-739845.pdf?src-supplier=Digi-Key; ComponentLink2URL: https://datasheet.ciiva.com/10018/htst-10018510.pdf?src-supplier=Avnet; ComponentLink2Description: https://datasheet.ciiva.com/10018/htst-10018510.pdf?src-supplier=Avnet
R105-R128 = RC0603JR-070RL: as R1 on sheet ADC_Channels; Mouser Part Number: 603-RC0603JR-070RL; Mouser Price/Stock: https://www.mouser.co.uk/ProductDetail/YAGEO/RC0603JR-070RL?qs=2cAdsCoAWRGWyPcuXgGiXQ%3D%3D; Manufacturer_Part_Number: RC0603JR-070RL; Datasheet Link: https://datasheet.datasheetarchive.com/originals/distributors/Datasheets_SAMA/902f9e387b938f871d31120f5fc1d65e.pdf

## Sheet ADC_Unity_Gain.SchDoc: ADC Utility Gain
size Tabloid; Date: 06/01/2023; Engineer: Terry D. Schevker; Revision: 1.0; SheetNumber: 5; SheetTotal: 7
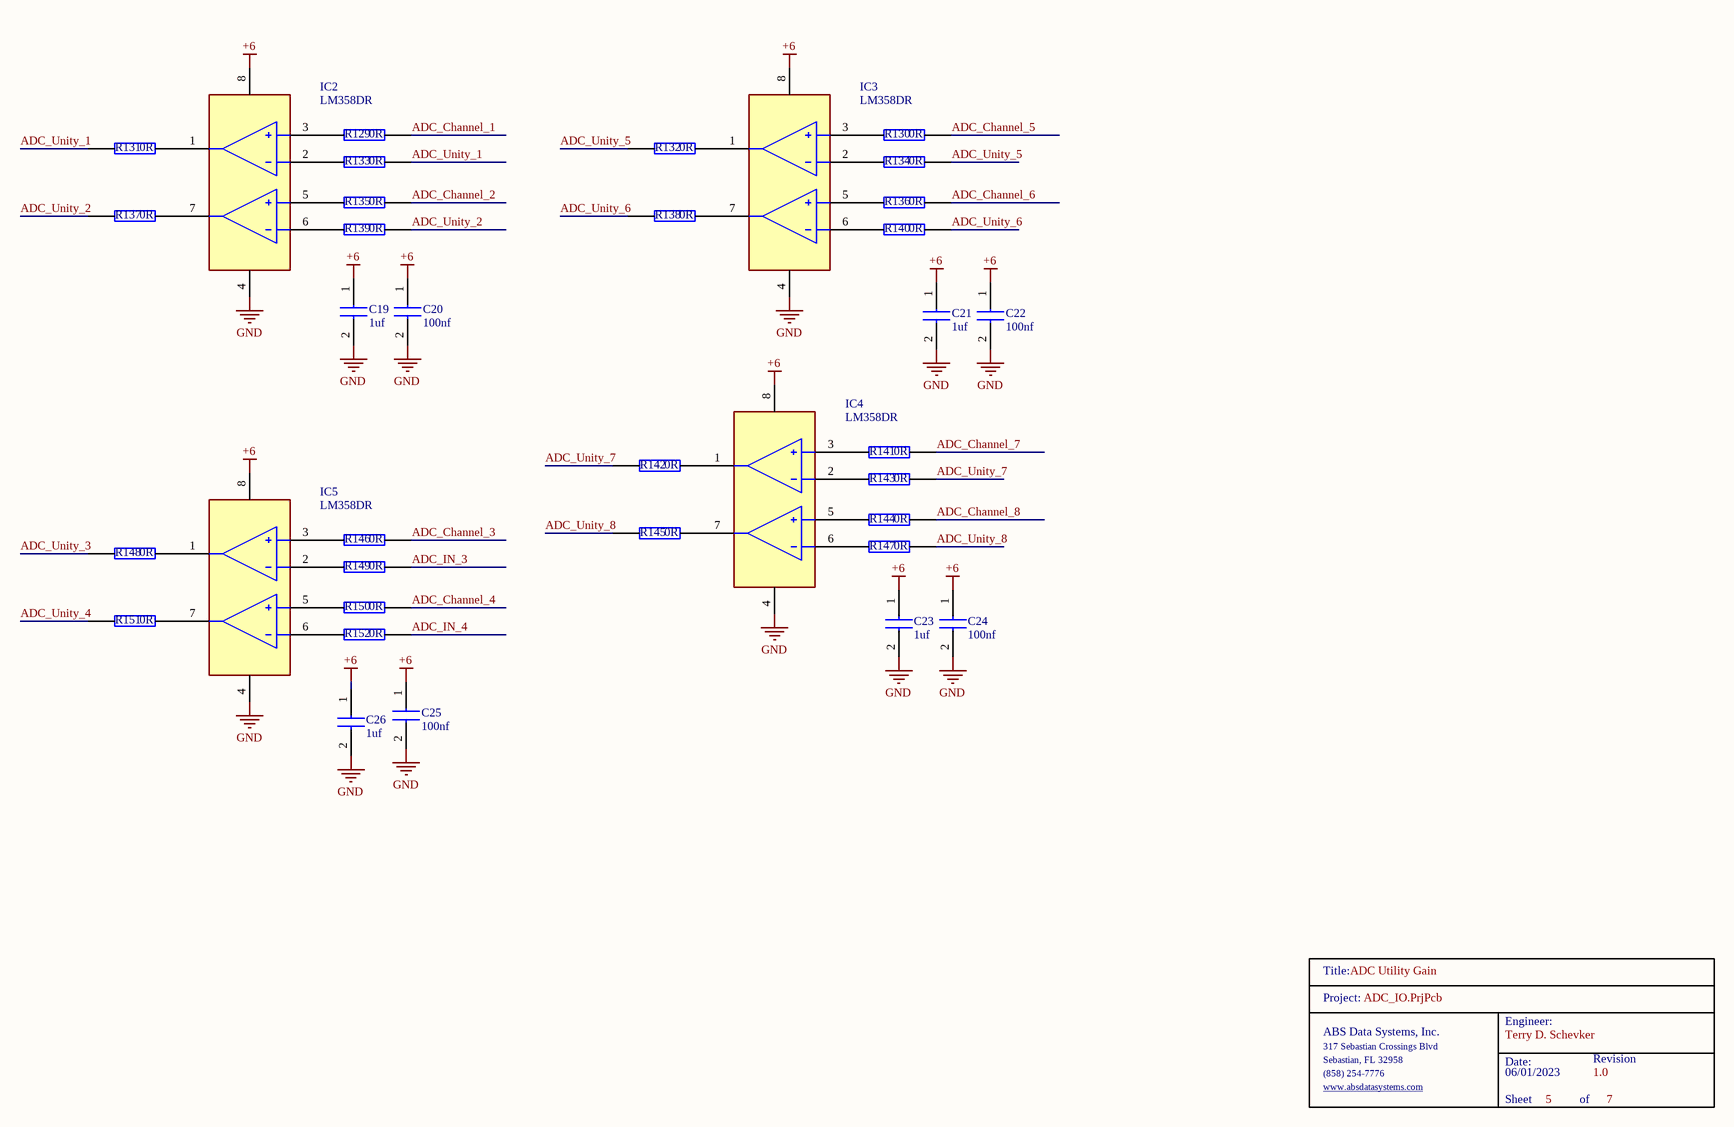
[diagram p4: ADC_Unity_Gain.SchDoc]

### Parts
C19  1uf  [0603]
C20  100nf  [0603]
C21  1uf  [0603]
C22  100nf  [0603]
C23  1uf  [0603]
C24  100nf  [0603]
C25  100nf  [0603]
C26  1uf  [0603]
IC2  LM358DR  [SOIC127P600X175-8N]
IC3  LM358DR  [SOIC127P600X175-8N]
IC4  LM358DR  [SOIC127P600X175-8N]
IC5  LM358DR  [SOIC127P600X175-8N]
R129  0R  [0603]
R130  0R  [0603]
R131  0R  [0603]
R132  0R  [0603]
R133  0R  [0603]
R134  0R  [0603]
R135  0R  [0603]
R136  0R  [0603]
R137  0R  [0603]
R138  0R  [0603]
R139  0R  [0603]
R140  0R  [0603]
R141  0R  [0603]
R142  0R  [0603]
R143  0R  [0603]
R144  0R  [0603]
R145  0R  [0603]
R146  0R  [0603]
R147  0R  [0603]
R148  0R  [0603]
R149  0R  [0603]
R150  0R  [0603]
R151  0R  [0603]
R152  0R  [0603]
TitleBlock_5  TitleBlock  (value not drawn)  (graphical)

### Nets
+6: C19.1 C20.1 C21.1 C22.1 C23.1 C24.1 C25.1 C26.1 IC2.8(V+) IC3.8(V+) IC4.8(V+) IC5.8(V+)
GND: C19.2 C20.2 C21.2 C22.2 C23.2 C24.2 C25.2 C26.2 IC2.4(V-) IC3.4(V-) IC4.4(V-) IC5.4(V-)
ADC_Channel_1: R129.2
ADC_Channel_2: R135.2
ADC_Channel_3: R146.2
ADC_Channel_4: R150.2
ADC_Channel_5: R130.2
ADC_Channel_6: R136.2
ADC_Channel_7: R141.2
ADC_Channel_8: R144.2
ADC_IN_3: R149.2
ADC_IN_4: R152.2
ADC_Unity_1: R131.1 R133.2
ADC_Unity_2: R137.1 R139.2
ADC_Unity_3: R148.1
ADC_Unity_4: R151.1
ADC_Unity_5: R132.1 R134.2
ADC_Unity_6: R138.1 R140.2
ADC_Unity_7: R142.1 R143.2
ADC_Unity_8: R145.1 R147.2
NetIC2_1: IC2.1(OUT1) R131.2
NetIC2_2: IC2.2(IN1-) R133.1
NetIC2_3: IC2.3(IN1+) R129.1
NetIC2_5: IC2.5(IN2+) R135.1
NetIC2_6: IC2.6(IN2-) R139.1
NetIC2_7: IC2.7(OUT2) R137.2
NetIC3_1: IC3.1(OUT1) R132.2
NetIC3_2: IC3.2(IN1-) R134.1
NetIC3_3: IC3.3(IN1+) R130.1
NetIC3_5: IC3.5(IN2+) R136.1
NetIC3_6: IC3.6(IN2-) R140.1
NetIC3_7: IC3.7(OUT2) R138.2
NetIC4_1: IC4.1(OUT1) R142.2
NetIC4_2: IC4.2(IN1-) R143.1
NetIC4_3: IC4.3(IN1+) R141.1
NetIC4_5: IC4.5(IN2+) R144.1
NetIC4_6: IC4.6(IN2-) R147.1
NetIC4_7: IC4.7(OUT2) R145.2
NetIC5_1: IC5.1(OUT1) R148.2
NetIC5_2: IC5.2(IN1-) R149.1
NetIC5_3: IC5.3(IN1+) R146.1
NetIC5_5: IC5.5(IN2+) R150.1
NetIC5_6: IC5.6(IN2-) R152.1
NetIC5_7: IC5.7(OUT2) R151.2

### Notes on the sheet
- (in symbol TitleBlock) Title:; Project:; Engineer:; ABS Data Systems, Inc.; 317 Sebastian Crossings Blvd; Sebastian, FL 32958; Date:; Revision; (858) 254-7776; www.absdatasystems.com; Sheet; of

### Library data of the parts
C19 C21 C23 C26 = CL10B105KA8NNNL: Samsung Electro-Mechanics 0603 1uf
C20 C22 C24 C25 = CL10B104JB8NNNC: Samsung Electro-Mechanics 0603 100nf
IC2-IC5 = LM358DR: Integrated Circuit; Manufacturer_Name: Texas Instruments; Datasheet Link: https://www.ti.com/lit/ds/symlink/lm358.pdf?ts=1593170624750&ref_url=https%253A%252F%252Fwww.ti.com%252Fstore%252Fti%252Fen%252Fp%252Fproduct%252F%253Fp%253DLM358DR%2526keyMatch%253DLM358DR%2526tisearch%253DSearch-EN-everything%2526usecase%253DOPN; Height: 1.75mm; Manufacturer_Part_Number: LM358DR; Mouser Part Number: 595-LM358DR; Mouser Price/Stock: https://www.mouser.co.uk/ProductDetail/Texas-Instruments/LM358DR?qs=Zu35EjizYSSY6pJ37yjmHA%3D%3D; Arrow Part Number: LM358DR; Arrow Price/Stock: https://www.arrow.com/en/products/lm358dr/texas-instruments?region=nac
R129-R152 = RC0603JR-070RL: as R1 on sheet ADC_Channels; Mouser Part Number: 603-RC0603JR-070RL; Mouser Price/Stock: https://www.mouser.co.uk/ProductDetail/YAGEO/RC0603JR-070RL?qs=2cAdsCoAWRGWyPcuXgGiXQ%3D%3D; Manufacturer_Part_Number: RC0603JR-070RL; Datasheet Link: https://datasheet.datasheetarchive.com/originals/distributors/Datasheets_SAMA/902f9e387b938f871d31120f5fc1d65e.pdf

## Sheet ADC_Calibration.SchDoc
size Tabloid; SheetNumber: 6; SheetTotal: 7
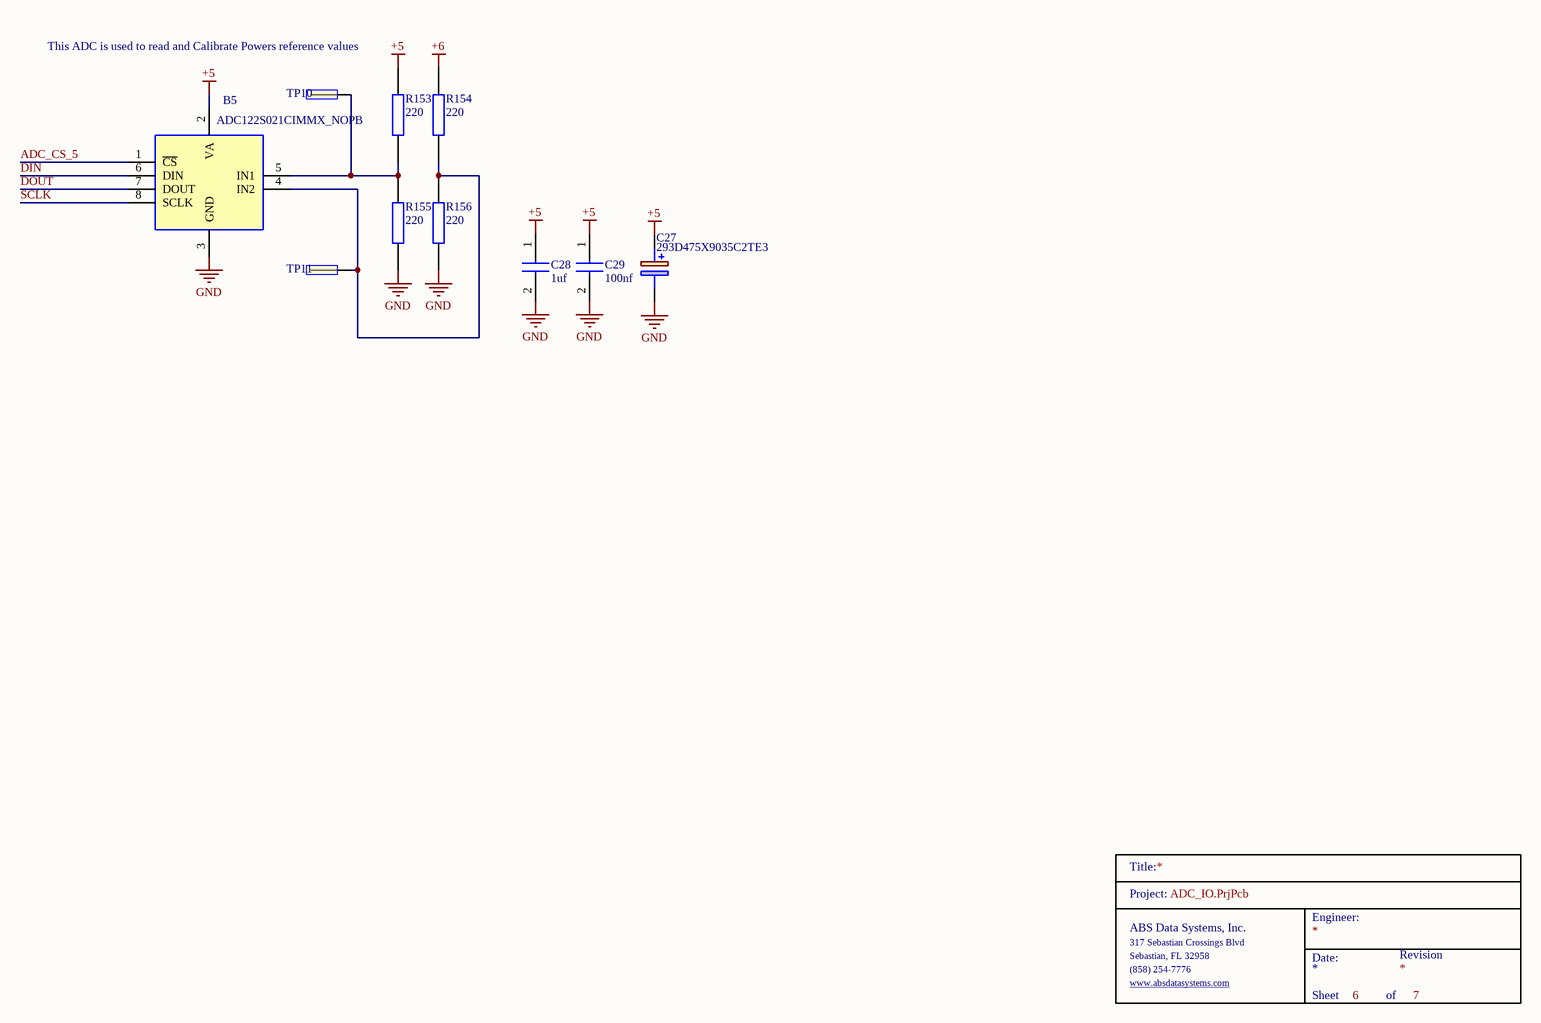
[diagram p5: ADC_Calibration.SchDoc]

### Parts
B5  ADC122S021CIMMX_NOPB  [SOP65P490X110-8N]
C27  293D475X9035C2TE3  [CAPPM6032X280N]
C28  1uf  [0603]
C29  100nf  [0603]
R153  220  [0603]
R154  220  [0603]
R155  220  [0603]
R156  220  [0603]
TitleBlock_6  TitleBlock  (value not drawn)  (graphical)
TP10  TP  [TP]  (value not drawn)
TP11  TP  [TP]  (value not drawn)

### Nets
+5: B5.2(VA) C27.1(+) C28.1 C29.1 R153.1
+6: R154.2
GND: B5.3(GND) C27.2(-) C28.2 C29.2 R155.1 R156.2
ADC_CS_5: B5.1(~{CS})
DIN: B5.6(DIN)
DOUT: B5.7(DOUT)
SCLK: B5.8(SCLK)
NetB5_4: B5.4(IN2) R154.1 R156.1 TP11.1
NetB5_5: B5.5(IN1) R153.2 R155.2 TP10.1

### Notes on the sheet
- This ADC is used to read and Calibrate Powers reference values
- (in symbol TitleBlock) Title:; Project:; Engineer:; ABS Data Systems, Inc.; 317 Sebastian Crossings Blvd; Sebastian, FL 32958; Date:; Revision; (858) 254-7776; www.absdatasystems.com; Sheet; of

### Library data of the parts
B5 = ADC122S021CIMMX_NOPB: as B1 on sheet ADC_Channels; Mouser Part Number: 926-A122S021CIMMXNPB; Mouser Price/Stock: https://www.mouser.co.uk/ProductDetail/Texas-Instruments/ADC122S021CIMMX-NOPB/?qs=7X5t%252BdzoRHB2bC7Teu8H3A%3D%3D; Datasheet Link: http://www.ti.com/lit/gpn/ADC122S021
C27 = 293D475X9035C2TE3: as C1 on sheet ADC_Channels; Mouser Part Number: 74-293D475X9035C2TE3; Mouser Price/Stock: https://www.mouser.co.uk/ProductDetail/Vishay-Sprague/293D475X9035C2TE3?qs=L4BSZja3YaK5uiX7PSIEuA%3D%3D; Manufacturer_Part_Number: 293D475X9035C2TE3; Datasheet Link: http://www.vishay.com/docs/40002/293d.pdf
C28 = CL10B105KA8NNNL: Samsung Electro-Mechanics 0603 1uf
C29 = CL10B104JB8NNNC: Samsung Electro-Mechanics 0603 100nf
R153-R156 = RC0603JR-07220RL: YAGEO 0603 220 ohm; Manufacturer_Name: KEMET; Manufacturer_Part_Number: RC0603JR-070RL; Geometry.Height: 0.55mm; Mouser Part Number: 603-RC0603JR-070RL; Mouser Price/Stock: https://www.mouser.co.uk/ProductDetail/YAGEO/RC0603JR-070RL?qs=2cAdsCoAWRGWyPcuXgGiXQ%3D%3D; Datasheet Link: https://datasheet.datasheetarchive.com/originals/distributors/Datasheets_SAMA/902f9e387b938f871d31120f5fc1d65e.pdf
TP10 TP11 = TP: as TP1 on sheet ADC_CPU; Supplier 1: Digi-Key; RoHS: Yes; Category: Headers and Wire Housings; Stock 1: 227; Pricing 1: 1=2.85000, 10=2.73600, 100=2.28000, 500=1.93800, 1000=1.65300, 5000=1.48200 (USD); Mount: Through Hole; Contact Plating: Gold; Contact Material: Bronze; Housing Material: Polyester; Housing Color: Black; Color: Black; Min Operating Temperature: -55°C; Max Operating Temperature: 125°C; Number of Rows: 2; Termination: Solder; Packaging: Rail/Tube; Orientation: Straight; Number of Positions: 16; Length: 27.94mm; Depth: 9.27mm; Contact Mating Length: 0.25inch; REACH SVHC: No SVHC; ComponentLink1URL: https://datasheet.ciiva.com/739/tst-mkt-739845.pdf?src-supplier=Digi-Key; ComponentLink1Description: https://datasheet.ciiva.com/739/tst-mkt-739845.pdf?src-supplier=Digi-Key; ComponentLink2URL: https://datasheet.ciiva.com/10018/htst-10018510.pdf?src-supplier=Avnet; ComponentLink2Description: https://datasheet.ciiva.com/10018/htst-10018510.pdf?src-supplier=Avnet

## Sheet ADC_Input.SchDoc: ADC Input
size Tabloid; Date: 06/01/2023; Engineer: Terry D. Schevker; Revision: 1.0; SheetNumber: 7; SheetTotal: 7
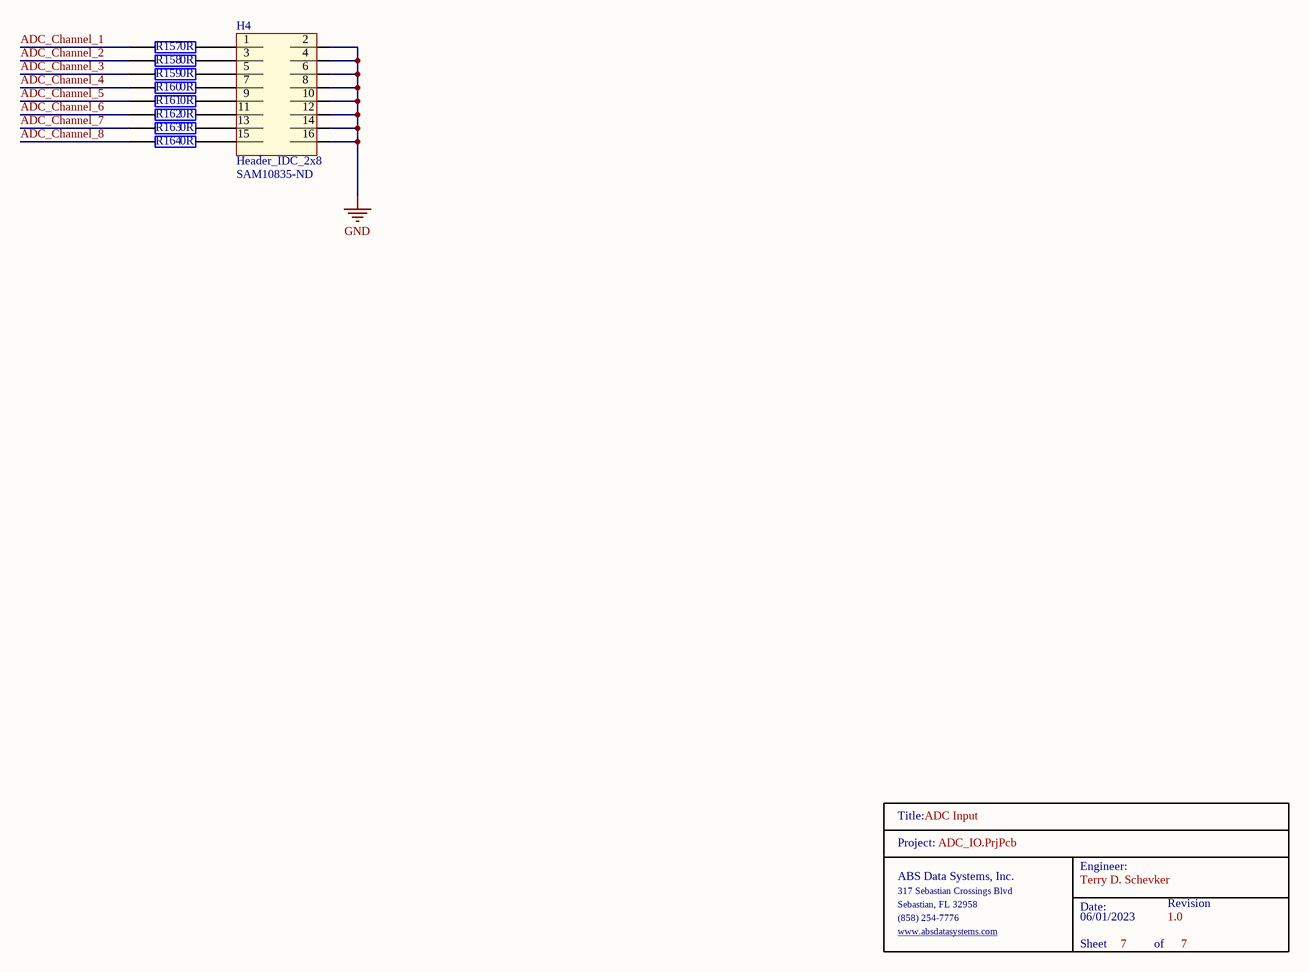
[diagram p6: ADC_Input.SchDoc]

### Parts
H4  Header_IDC_2x8  Supplier Part Number 1: SAM10835-ND  [HEADER16]
R157  0R  [0603]
R158  0R  [0603]
R159  0R  [0603]
R160  0R  [0603]
R161  0R  [0603]
R162  0R  [0603]
R163  0R  [0603]
R164  0R  [0603]
TitleBlock_7  TitleBlock  (value not drawn)  (graphical)

### Nets
GND: H4.2 H4.4 H4.6 H4.8 H4.10 H4.12 H4.14 H4.16
ADC_Channel_1: R157.1
ADC_Channel_2: R158.1
ADC_Channel_3: R159.1
ADC_Channel_4: R160.1
ADC_Channel_5: R161.1
ADC_Channel_6: R162.1
ADC_Channel_7: R163.1
ADC_Channel_8: R164.1
NetH4_1: H4.1 R157.2
NetH4_3: H4.3 R158.2
NetH4_5: H4.5 R159.2
NetH4_7: H4.7 R160.2
NetH4_9: H4.9 R161.2
NetH4_11: H4.11 R162.2
NetH4_13: H4.13 R163.2
NetH4_15: H4.15 R164.2

### Notes on the sheet
- (in symbol TitleBlock) Title:; Project:; Engineer:; ABS Data Systems, Inc.; 317 Sebastian Crossings Blvd; Sebastian, FL 32958; Date:; Revision; (858) 254-7776; www.absdatasystems.com; Sheet; of

### Library data of the parts
H4 = Header_IDC_2x8: as H2 on sheet ADC_CPU; Supplier 1: Digi-Key; RoHS: Yes; Category: Headers and Wire Housings; Stock 1: 227; Pricing 1: 1=2.85000, 10=2.73600, 100=2.28000, 500=1.93800, 1000=1.65300, 5000=1.48200 (USD); Mount: Through Hole; Contact Plating: Gold; Contact Material: Bronze; Housing Material: Polyester; Housing Color: Black; Color: Black; Min Operating Temperature: -55°C; Max Operating Temperature: 125°C; Number of Rows: 2; Termination: Solder; Packaging: Rail/Tube; Orientation: Straight; Number of Positions: 16; Length: 27.94mm; Depth: 9.27mm; Contact Mating Length: 0.25inch; REACH SVHC: No SVHC; ComponentLink1URL: https://datasheet.ciiva.com/739/tst-mkt-739845.pdf?src-supplier=Digi-Key; ComponentLink1Description: https://datasheet.ciiva.com/739/tst-mkt-739845.pdf?src-supplier=Digi-Key; ComponentLink2URL: https://datasheet.ciiva.com/10018/htst-10018510.pdf?src-supplier=Avnet; ComponentLink2Description: https://datasheet.ciiva.com/10018/htst-10018510.pdf?src-supplier=Avnet
R157-R164 = RC0603JR-070RL: as R1 on sheet ADC_Channels; Mouser Part Number: 603-RC0603JR-070RL; Mouser Price/Stock: https://www.mouser.co.uk/ProductDetail/YAGEO/RC0603JR-070RL?qs=2cAdsCoAWRGWyPcuXgGiXQ%3D%3D; Manufacturer_Part_Number: RC0603JR-070RL; Datasheet Link: https://datasheet.datasheetarchive.com/originals/distributors/Datasheets_SAMA/902f9e387b938f871d31120f5fc1d65e.pdf

## Nets that join several sheets
+3.3: ADC_LED_Monitor (R37.1), ADC_CPU (H2.3 TP4.1)
+5: ADC_Channels (16 pins), ADC_LED_Monitor (24 pins), ADC_CPU (11 pins), ADC_Calibration (5 pins)
+6: ADC_LED_Monitor (R38.2), ADC_CPU (R64.2), ADC_Unity_Gain (12 pins), ADC_Calibration (R154.2)
GND: ADC_Channels (16 pins), ADC_LED_Monitor (7 pins), ADC_CPU (11 pins), ADC_Unity_Gain (12 pins), ADC_Calibration (6 pins), ADC_Input (8 pins)
ADC_Channel_1: ADC_Configuration (R105.1), ADC_Unity_Gain (R129.2), ADC_Input (R157.1)
ADC_Channel_2: ADC_Configuration (R111.1), ADC_Unity_Gain (R135.2), ADC_Input (R158.1)
ADC_Channel_3: ADC_Configuration (R117.1), ADC_Unity_Gain (R146.2), ADC_Input (R159.1)
ADC_Channel_4: ADC_Configuration (R123.1), ADC_Unity_Gain (R150.2), ADC_Input (R160.1)
ADC_Channel_5: ADC_Configuration (R128.2), ADC_Unity_Gain (R130.2), ADC_Input (R161.1)
ADC_Channel_6: ADC_Configuration (R122.2), ADC_Unity_Gain (R136.2), ADC_Input (R162.1)
ADC_Channel_7: ADC_Configuration (R116.2), ADC_Unity_Gain (R141.2), ADC_Input (R163.1)
ADC_Channel_8: ADC_Configuration (R110.2), ADC_Unity_Gain (R144.2), ADC_Input (R164.1)
ADC_CS_1: ADC_Channels (R2.1), ADC_LED_Monitor (R53.1), ADC_CPU (R95.1)
ADC_CS_2: ADC_Channels (R13.1), ADC_LED_Monitor (R54.1), ADC_CPU (R97.1)
ADC_CS_3: ADC_Channels (R1.1), ADC_LED_Monitor (R55.1), ADC_CPU (R99.1)
ADC_CS_4: ADC_Channels (R14.1), ADC_LED_Monitor (R56.1), ADC_CPU (R101.1)
ADC_CS_5: ADC_LED_Monitor (R57.1), ADC_CPU (R94.2), ADC_Calibration (B5.1)
ADC_IN_1: ADC_Channels (R6.2), ADC_Configuration (R107.1)
ADC_IN_2: ADC_Channels (R10.2), ADC_Configuration (R113.1)
ADC_IN_3: ADC_Channels (R16.2), ADC_Configuration (R119.1), ADC_Unity_Gain (R149.2)
ADC_IN_4: ADC_Channels (R20.2), ADC_Configuration (R125.1), ADC_Unity_Gain (R152.2)
ADC_IN_5: ADC_Channels (R4.2), ADC_Configuration (R126.2)
ADC_IN_6: ADC_Channels (R8.2), ADC_Configuration (R120.2)
ADC_IN_7: ADC_Channels (R18.2), ADC_Configuration (R114.2)
ADC_IN_8: ADC_Channels (R22.2), ADC_Configuration (R108.2)
ADC_Unity_1: ADC_Configuration (R109.1), ADC_Unity_Gain (R131.1 R133.2)
ADC_Unity_2: ADC_Configuration (R115.1), ADC_Unity_Gain (R137.1 R139.2)
ADC_Unity_3: ADC_Configuration (R121.1), ADC_Unity_Gain (R148.1)
ADC_Unity_4: ADC_Configuration (R127.1), ADC_Unity_Gain (R151.1)
ADC_Unity_5: ADC_Configuration (R124.2), ADC_Unity_Gain (R132.1 R134.2)
ADC_Unity_6: ADC_Configuration (R118.2), ADC_Unity_Gain (R138.1 R140.2)
ADC_Unity_7: ADC_Configuration (R112.2), ADC_Unity_Gain (R142.1 R143.2)
ADC_Unity_8: ADC_Configuration (R106.2), ADC_Unity_Gain (R145.1 R147.2)
CPU_CS: ADC_LED_Monitor (R52.1), ADC_CPU (R85.2 R102.2)
CPU_D0: ADC_LED_Monitor (U1.2), ADC_CPU (R66.1 R70.1)
CPU_D1: ADC_LED_Monitor (U1.4), ADC_CPU (R68.1 R73.1)
CPU_D2: ADC_LED_Monitor (U1.6), ADC_CPU (R71.1 R76.1)
CPU_D3: ADC_LED_Monitor (U1.8), ADC_CPU (R74.1 R80.1)
CPU_D4: ADC_LED_Monitor (U1.11), ADC_CPU (R78.1 R84.1)
CPU_D5: ADC_LED_Monitor (U1.13), ADC_CPU (R82.1 R88.1)
CPU_D6: ADC_LED_Monitor (U1.15), ADC_CPU (R86.1 R92.1)
CPU_D7: ADC_LED_Monitor (U1.17), ADC_CPU (R90.1 R93.1)
CPU_nInt: ADC_LED_Monitor (R60.1), ADC_CPU (R77.2 R104.2)
CPU_Reset: ADC_LED_Monitor (R61.1), ADC_CPU (R69.2 R89.2)
CPU_RnW: ADC_LED_Monitor (R50.1 R51.1), ADC_CPU (R81.2 R103.2)
DIN: ADC_Channels (R3.1 R5.1 R15.1 R17.1), ADC_LED_Monitor (R47.1), ADC_CPU (R96.2), ADC_Calibration (B5.6)
DOUT: ADC_Channels (R7.1 R9.1 R19.1 R21.1), ADC_LED_Monitor (R48.1), ADC_CPU (R98.2), ADC_Calibration (B5.7)
SCLK: ADC_Channels (R11.1 R12.1 R23.1 R24.1), ADC_LED_Monitor (R49.1), ADC_CPU (R100.2), ADC_Calibration (B5.8)